# EAGLE design InstrumentHubs (EAGLE 7.6.0)

## Sheet 1 of 9
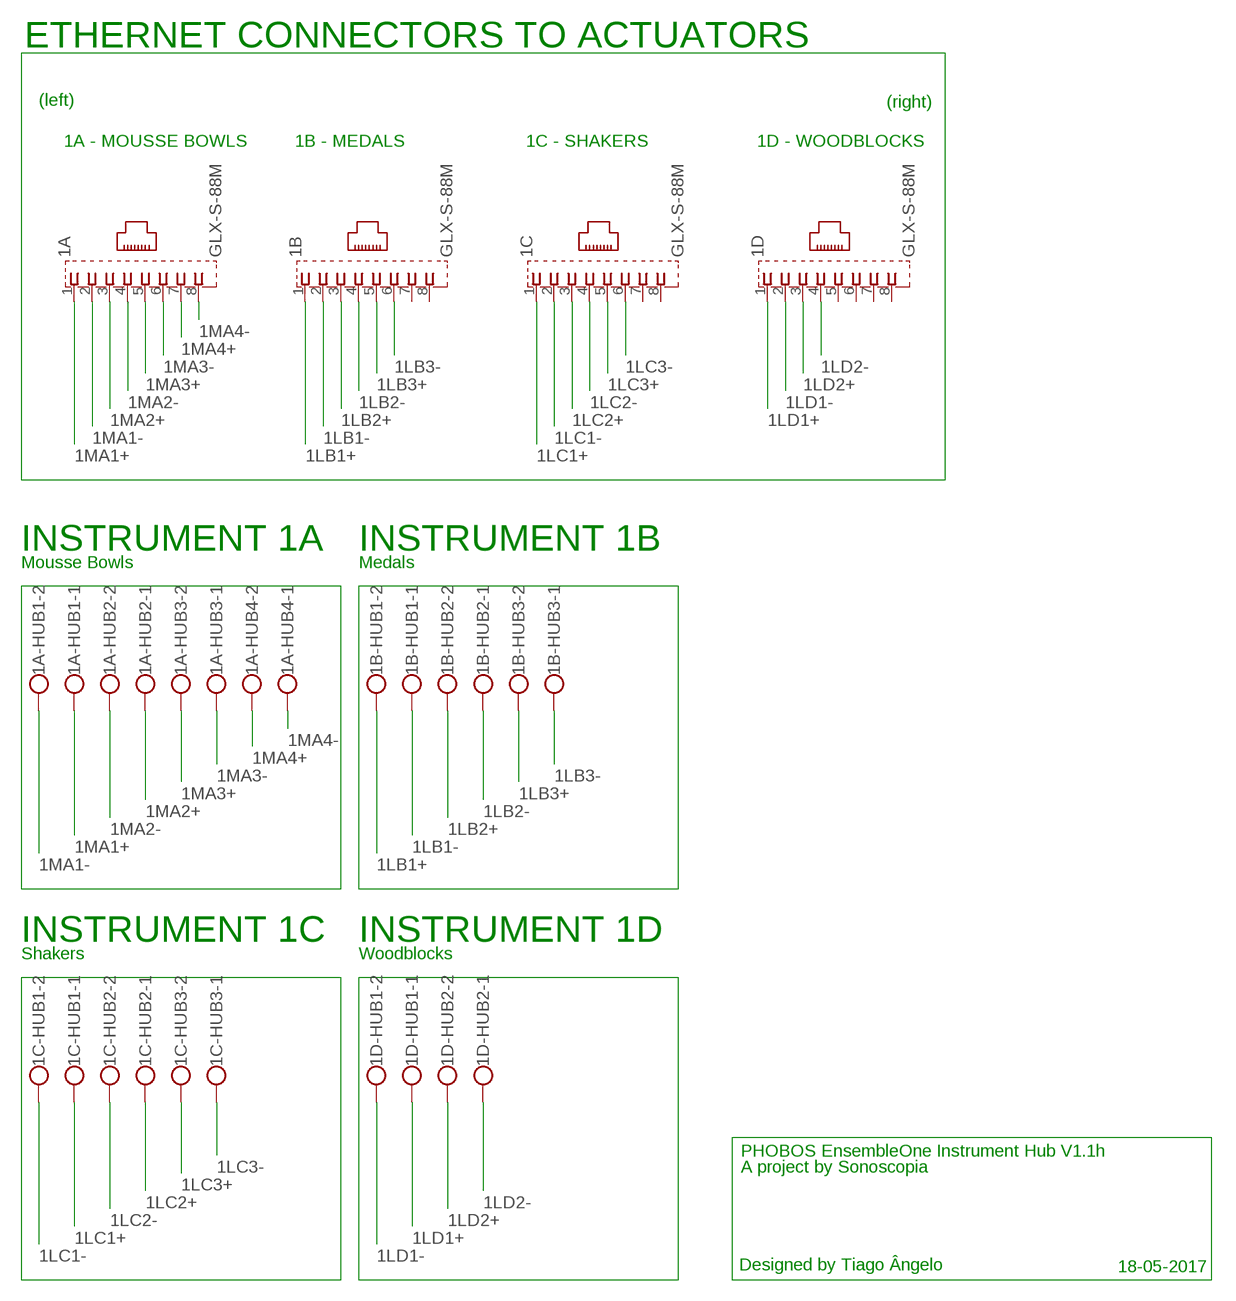
[diagram p0: schematic, sheet 1]

### Parts
1A  GLX-S-88M  [GLX-S-88M]
1A-HUB1  W237-102  [W237-102]
1A-HUB2  W237-102  [W237-102]
1A-HUB3  W237-102  [W237-102]
1A-HUB4  W237-102  [W237-102]
1B  GLX-S-88M  [GLX-S-88M]
1B-HUB1  W237-102  [W237-102]
1B-HUB2  W237-102  [W237-102]
1B-HUB3  W237-102  [W237-102]
1C  GLX-S-88M  [GLX-S-88M]
1C-HUB1  W237-102  [W237-102]
1C-HUB2  W237-102  [W237-102]
1C-HUB3  W237-102  [W237-102]
1D  GLX-S-88M  [GLX-S-88M]
1D-HUB1  W237-102  [W237-102]
1D-HUB2  W237-102  [W237-102]

### Nets
1LB1+: 1B-HUB1.2 1B.1
1LB1-: 1B-HUB1.1 1B.2
1LB2+: 1B-HUB2.2 1B.3
1LB2-: 1B-HUB2.1 1B.4
1LB3+: 1B-HUB3.2 1B.5
1LB3-: 1B-HUB3.1 1B.6
1LC1+: 1C-HUB1.1 1C.1
1LC1-: 1C-HUB1.2 1C.2
1LC2+: 1C-HUB2.1 1C.3
1LC2-: 1C-HUB2.2 1C.4
1LC3+: 1C-HUB3.2 1C.5
1LC3-: 1C-HUB3.1 1C.6
1LD1+: 1D-HUB1.1 1D.1
1LD1-: 1D-HUB1.2 1D.2
1LD2+: 1D-HUB2.2 1D.3
1LD2-: 1D-HUB2.1 1D.4
1MA1+: 1A-HUB1.1 1A.1
1MA1-: 1A-HUB1.2 1A.2
1MA2+: 1A-HUB2.1 1A.3
1MA2-: 1A-HUB2.2 1A.4
1MA3+: 1A-HUB3.2 1A.5
1MA3-: 1A-HUB3.1 1A.6
1MA4+: 1A-HUB4.2 1A.7
1MA4-: 1A-HUB4.1 1A.8
Unconnected: 1B.7 1B.8 1C.7 1C.8 1D.5 1D.6 1D.7 1D.8

### Notes on the sheet
- ETHERNET CONNECTORS TO ACTUATORS
- (left) | (right)
- 1A - MOUSSE BOWLS | 1B - MEDALS | 1C - SHAKERS | 1D - WOODBLOCKS
- INSTRUMENT 1A | INSTRUMENT 1B
- Mousse Bowls | Medals
- INSTRUMENT 1C | INSTRUMENT 1D
- Shakers | Woodblocks
- PHOBOS EnsembleOne Instrument Hub V1.1h
- A project by Sonoscopia
- Designed by Tiago Ângelo | 18-05-2017

## Sheet 2 of 9
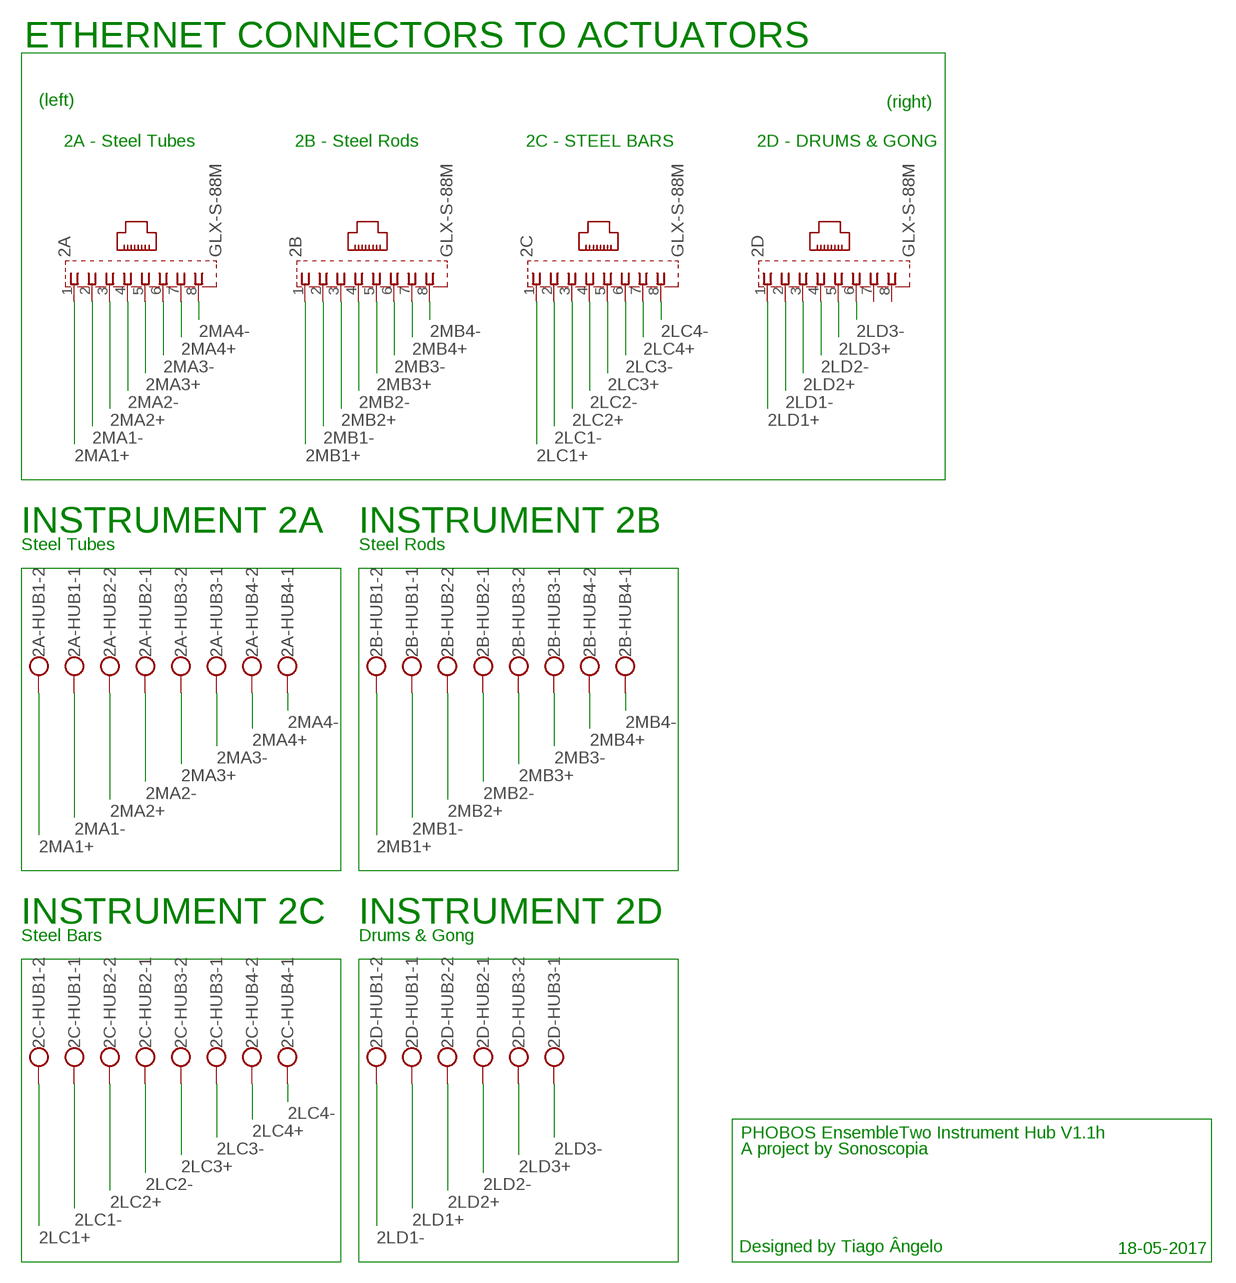
[diagram p1: schematic, sheet 2]

### Parts
2A  GLX-S-88M  [GLX-S-88M]
2A-HUB1  W237-102  [W237-102]
2A-HUB2  W237-102  [W237-102]
2A-HUB3  W237-102  [W237-102]
2A-HUB4  W237-102  [W237-102]
2B  GLX-S-88M  [GLX-S-88M]
2B-HUB1  W237-102  [W237-102]
2B-HUB2  W237-102  [W237-102]
2B-HUB3  W237-102  [W237-102]
2B-HUB4  W237-102  [W237-102]
2C  GLX-S-88M  [GLX-S-88M]
2C-HUB1  W237-102  [W237-102]
2C-HUB2  W237-102  [W237-102]
2C-HUB3  W237-102  [W237-102]
2C-HUB4  W237-102  [W237-102]
2D  GLX-S-88M  [GLX-S-88M]
2D-HUB1  W237-102  [W237-102]
2D-HUB2  W237-102  [W237-102]
2D-HUB3  W237-102  [W237-102]

### Nets
2LC1+: 2C-HUB1.2 2C.1
2LC1-: 2C-HUB1.1 2C.2
2LC2+: 2C-HUB2.2 2C.3
2LC2-: 2C-HUB2.1 2C.4
2LC3+: 2C-HUB3.2 2C.5
2LC3-: 2C-HUB3.1 2C.6
2LC4+: 2C-HUB4.2 2C.7
2LC4-: 2C-HUB4.1 2C.8
2LD1+: 2D-HUB1.1 2D.1
2LD1-: 2D-HUB1.2 2D.2
2LD2+: 2D-HUB2.2 2D.3
2LD2-: 2D-HUB2.1 2D.4
2LD3+: 2D-HUB3.2 2D.5
2LD3-: 2D-HUB3.1 2D.6
2MA1+: 2A-HUB1.2 2A.1
2MA1-: 2A-HUB1.1 2A.2
2MA2+: 2A-HUB2.2 2A.3
2MA2-: 2A-HUB2.1 2A.4
2MA3+: 2A-HUB3.2 2A.5
2MA3-: 2A-HUB3.1 2A.6
2MA4+: 2A-HUB4.2 2A.7
2MA4-: 2A-HUB4.1 2A.8
2MB1+: 2B-HUB1.2 2B.1
2MB1-: 2B-HUB1.1 2B.2
2MB2+: 2B-HUB2.2 2B.3
2MB2-: 2B-HUB2.1 2B.4
2MB3+: 2B-HUB3.2 2B.5
2MB3-: 2B-HUB3.1 2B.6
2MB4+: 2B-HUB4.2 2B.7
2MB4-: 2B-HUB4.1 2B.8
Unconnected: 2D.7 2D.8

### Notes on the sheet
- ETHERNET CONNECTORS TO ACTUATORS
- (left) | (right)
- 2A - Steel Tubes | 2B - Steel Rods | 2C - STEEL BARS | 2D - DRUMS & GONG
- INSTRUMENT 2A | INSTRUMENT 2B
- Steel Tubes | Steel Rods
- INSTRUMENT 2C | INSTRUMENT 2D
- Steel Bars | Drums & Gong
- PHOBOS EnsembleTwo Instrument Hub V1.1h
- A project by Sonoscopia
- Designed by Tiago Ângelo | 18-05-2017

## Sheet 3 of 9
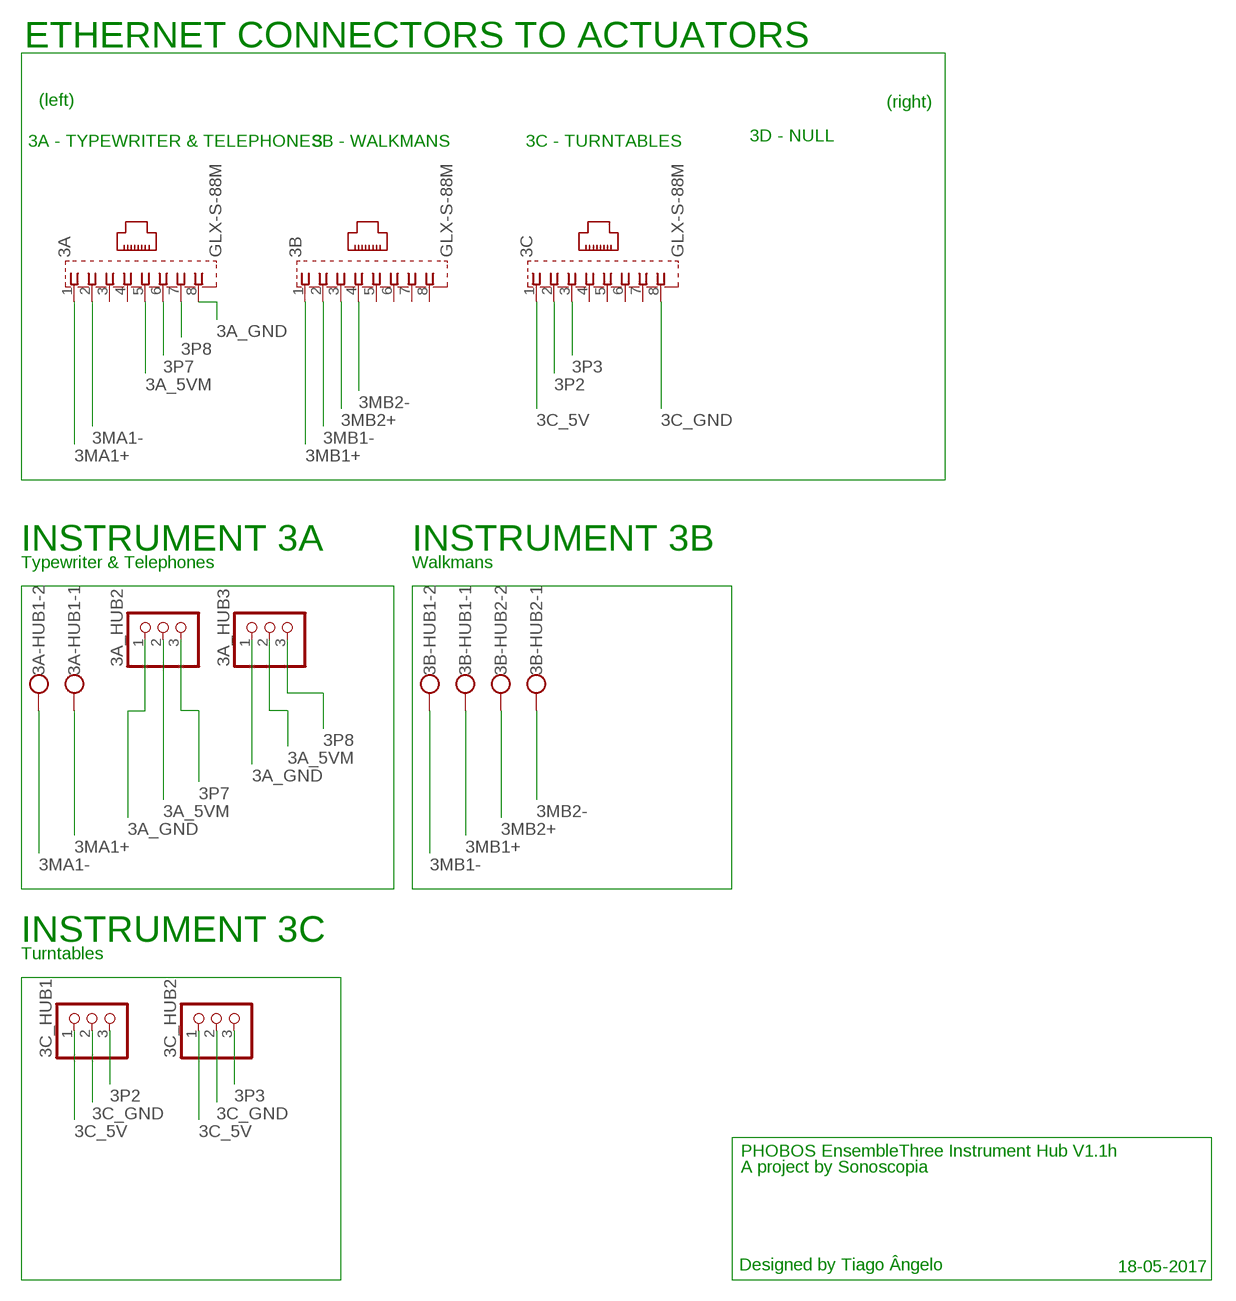
[diagram p2: schematic, sheet 3]

### Parts
3A  GLX-S-88M  [GLX-S-88M]
3A-HUB1  W237-102  [W237-102]
3A_HUB2  PINHD-1X3  [1X03]
3A_HUB3  PINHD-1X3  [1X03]
3B  GLX-S-88M  [GLX-S-88M]
3B-HUB1  W237-102  [W237-102]
3B-HUB2  W237-102  [W237-102]
3C  GLX-S-88M  [GLX-S-88M]
3C_HUB1  PINHD-1X3  [1X03]
3C_HUB2  PINHD-1X3  [1X03]

### Nets
3A_5VM: 3A.5 3A_HUB2.2 3A_HUB3.2
3A_GND [GND]: 3A.8 3A_HUB2.1 3A_HUB3.1
3C_5V: 3C.1 3C_HUB1.1 3C_HUB2.1
3C_GND [GND]: 3C.8 3C_HUB1.2 3C_HUB2.2
3MA1+: 3A-HUB1.1 3A.1
3MA1-: 3A-HUB1.2 3A.2
3MB1+: 3B-HUB1.1 3B.1
3MB1-: 3B-HUB1.2 3B.2
3MB2+: 3B-HUB2.2 3B.3
3MB2-: 3B-HUB2.1 3B.4
3P2: 3C.2 3C_HUB1.3
3P3: 3C.3 3C_HUB2.3
3P7: 3A.6 3A_HUB2.3
3P8: 3A.7 3A_HUB3.3
Unconnected: 3A.3 3A.4 3B.5 3B.6 3B.7 3B.8 3C.4 3C.5 3C.6 3C.7

### Notes on the sheet
- ETHERNET CONNECTORS TO ACTUATORS
- (left) | (right)
- 3D - NULL
- 3A - TYPEWRITER & TELEPHONES | 3B - WALKMANS | 3C - TURNTABLES
- INSTRUMENT 3A | INSTRUMENT 3B
- Typewriter & Telephones | Walkmans
- INSTRUMENT 3C
- Turntables
- PHOBOS EnsembleThree Instrument Hub V1.1h
- A project by Sonoscopia
- Designed by Tiago Ângelo | 18-05-2017

## Sheet 4 of 9
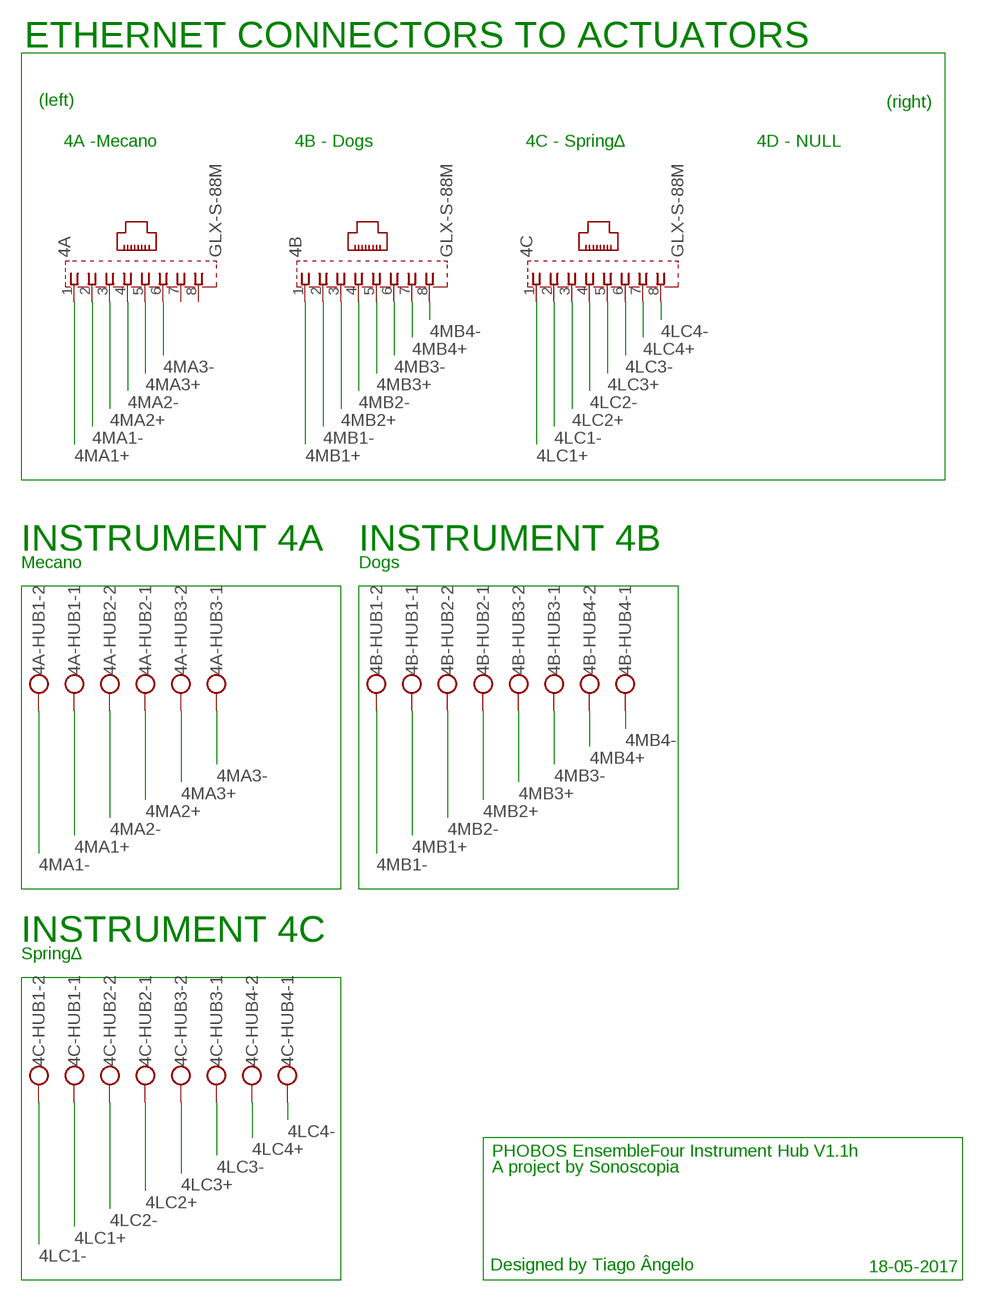
[diagram p3: schematic, sheet 4]

### Parts
4A  GLX-S-88M  [GLX-S-88M]
4A-HUB1  W237-102  [W237-102]
4A-HUB2  W237-102  [W237-102]
4A-HUB3  W237-102  [W237-102]
4B  GLX-S-88M  [GLX-S-88M]
4B-HUB1  W237-102  [W237-102]
4B-HUB2  W237-102  [W237-102]
4B-HUB3  W237-102  [W237-102]
4B-HUB4  W237-102  [W237-102]
4C  GLX-S-88M  [GLX-S-88M]
4C-HUB1  W237-102  [W237-102]
4C-HUB2  W237-102  [W237-102]
4C-HUB3  W237-102  [W237-102]
4C-HUB4  W237-102  [W237-102]

### Nets
4LC1+: 4C-HUB1.1 4C.1
4LC1-: 4C-HUB1.2 4C.2
4LC2+: 4C-HUB2.1 4C.3
4LC2-: 4C-HUB2.2 4C.4
4LC3+: 4C-HUB3.2 4C.5
4LC3-: 4C-HUB3.1 4C.6
4LC4+: 4C-HUB4.2 4C.7
4LC4-: 4C-HUB4.1 4C.8
4MA1+: 4A-HUB1.1 4A.1
4MA1-: 4A-HUB1.2 4A.2
4MA2+: 4A-HUB2.1 4A.3
4MA2-: 4A-HUB2.2 4A.4
4MA3+: 4A-HUB3.2 4A.5
4MA3-: 4A-HUB3.1 4A.6
4MB1+: 4B-HUB1.1 4B.1
4MB1-: 4B-HUB1.2 4B.2
4MB2+: 4B-HUB2.1 4B.3
4MB2-: 4B-HUB2.2 4B.4
4MB3+: 4B-HUB3.2 4B.5
4MB3-: 4B-HUB3.1 4B.6
4MB4+: 4B-HUB4.2 4B.7
4MB4-: 4B-HUB4.1 4B.8
Unconnected: 4A.7 4A.8

### Notes on the sheet
- ETHERNET CONNECTORS TO ACTUATORS
- (left) | (right)
- 4A -Mecano | 4B - Dogs | 4C - Spring∆ | 4D - NULL
- INSTRUMENT 4A | INSTRUMENT 4B
- Mecano | Dogs
- INSTRUMENT 4C
- Spring∆
- PHOBOS EnsembleFour Instrument Hub V1.1h
- A project by Sonoscopia
- Designed by Tiago Ângelo | 18-05-2017

## Sheet 5 of 9
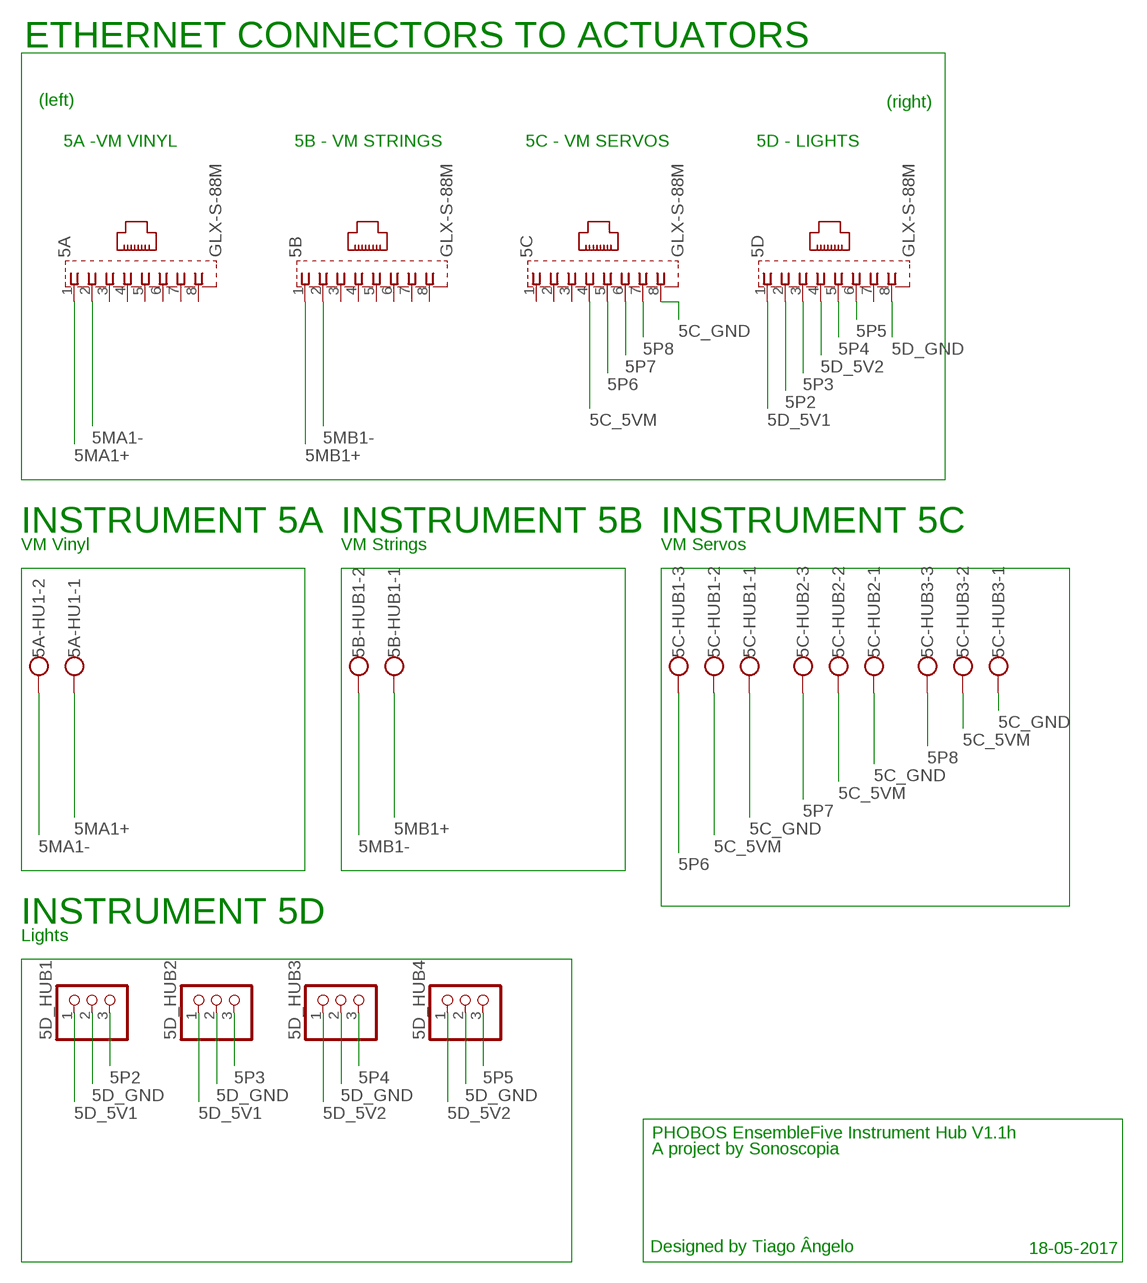
[diagram p4: schematic, sheet 5]

### Parts
5A  GLX-S-88M  [GLX-S-88M]
5A-HU1  W237-102  [W237-102]
5B  GLX-S-88M  [GLX-S-88M]
5B-HUB1  W237-102  [W237-102]
5C  GLX-S-88M  [GLX-S-88M]
5C-HUB1  W237-103  [W237-103]
5C-HUB2  W237-103  [W237-103]
5C-HUB3  W237-103  [W237-103]
5D  GLX-S-88M  [GLX-S-88M]
5D_HUB1  PINHD-1X3  [1X03]
5D_HUB2  PINHD-1X3  [1X03]
5D_HUB3  PINHD-1X3  [1X03]
5D_HUB4  PINHD-1X3  [1X03]

### Nets
5C_5VM: 5C-HUB1.2 5C-HUB2.2 5C-HUB3.2 5C.4
5C_GND [GND]: 5C-HUB1.1 5C-HUB2.1 5C-HUB3.1 5C.8
5D_5V1: 5D.1 5D_HUB1.1 5D_HUB2.1
5D_5V2: 5D.4 5D_HUB3.1 5D_HUB4.1
5D_GND [GND]: 5D.8 5D_HUB1.2 5D_HUB2.2 5D_HUB3.2 5D_HUB4.2
5MA1+: 5A-HU1.1 5A.1
5MA1-: 5A-HU1.2 5A.2
5MB1+: 5B-HUB1.1 5B.1
5MB1-: 5B-HUB1.2 5B.2
5P2: 5D.2 5D_HUB1.3
5P3: 5D.3 5D_HUB2.3
5P4: 5D.5 5D_HUB3.3
5P5: 5D.6 5D_HUB4.3
5P6: 5C-HUB1.3 5C.5
5P7: 5C-HUB2.3 5C.6
5P8: 5C-HUB3.3 5C.7
Unconnected: 5A.3 5A.4 5A.5 5A.6 5A.7 5A.8 5B.3 5B.4 5B.5 5B.6 5B.7 5B.8 5C.1 5C.2 5C.3 5D.7

### Notes on the sheet
- ETHERNET CONNECTORS TO ACTUATORS
- (left) | (right)
- 5A -VM VINYL | 5B - VM STRINGS | 5C - VM SERVOS | 5D - LIGHTS
- INSTRUMENT 5A | INSTRUMENT 5B | INSTRUMENT 5C
- VM Vinyl | VM Strings | VM Servos
- INSTRUMENT 5D
- Lights
- PHOBOS EnsembleFive Instrument Hub V1.1h
- A project by Sonoscopia
- Designed by Tiago Ângelo | 18-05-2017

## Sheet 6 of 9
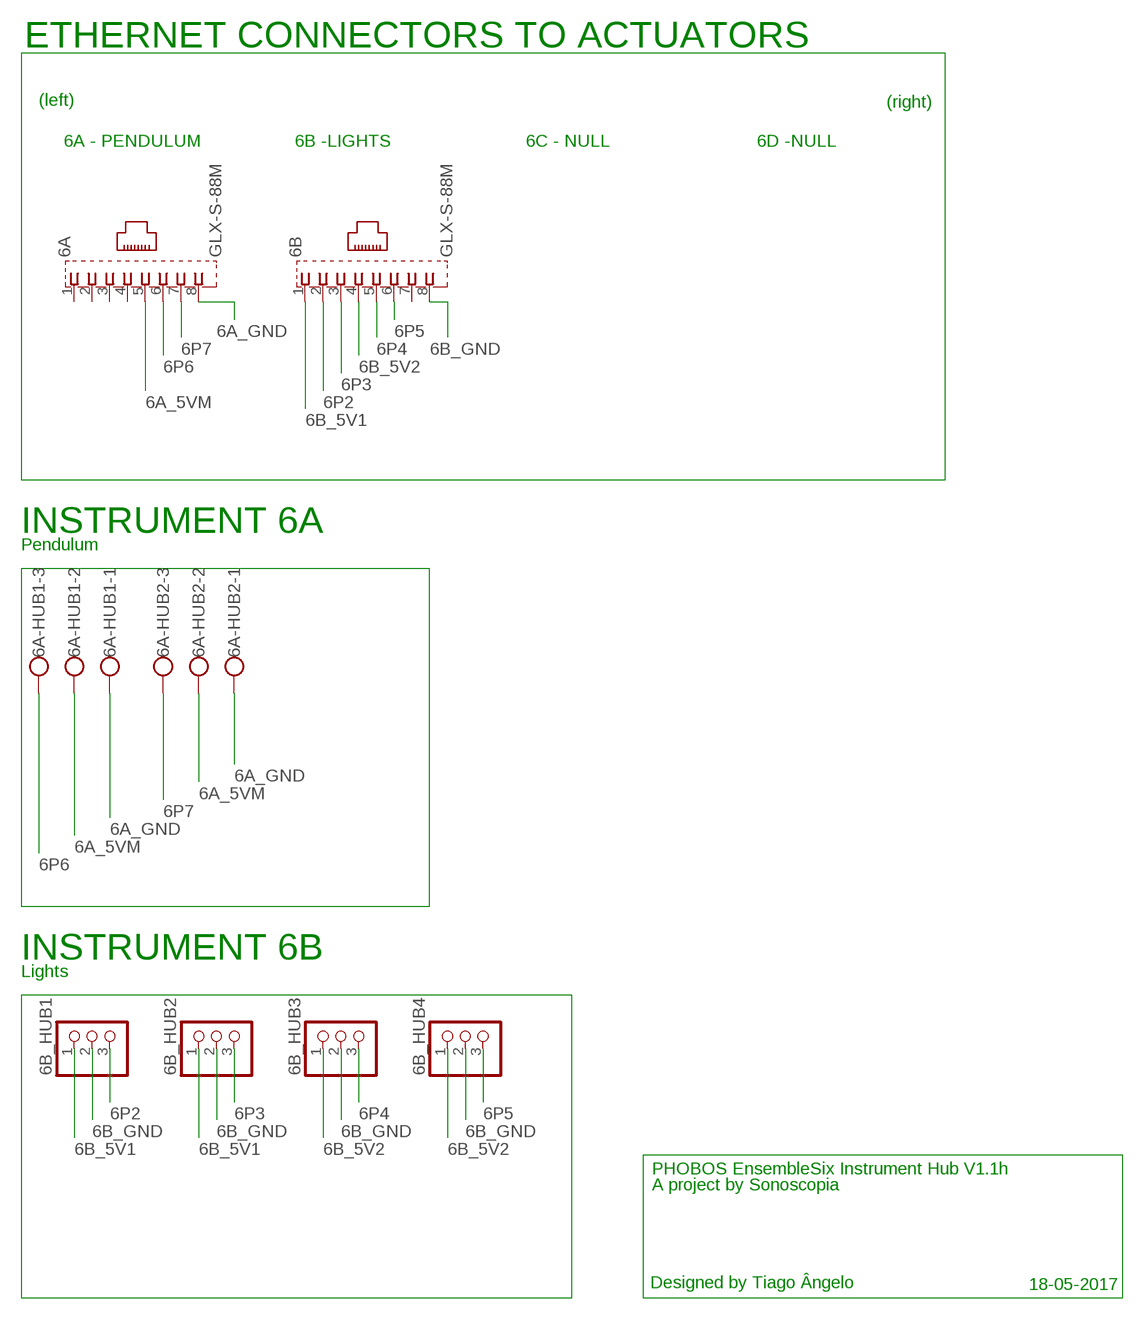
[diagram p5: schematic, sheet 6]

### Parts
6A  GLX-S-88M  [GLX-S-88M]
6A-HUB1  W237-103  [W237-103]
6A-HUB2  W237-103  [W237-103]
6B  GLX-S-88M  [GLX-S-88M]
6B_HUB1  PINHD-1X3  [1X03]
6B_HUB2  PINHD-1X3  [1X03]
6B_HUB3  PINHD-1X3  [1X03]
6B_HUB4  PINHD-1X3  [1X03]

### Nets
6A_5VM [5VM]: 6A-HUB1.2 6A-HUB2.2 6A.5
6A_GND [GND]: 6A-HUB1.1 6A-HUB2.1 6A.8
6B_5V1: 6B.1 6B_HUB1.1 6B_HUB2.1
6B_5V2: 6B.4 6B_HUB3.1 6B_HUB4.1
6B_GND [GND]: 6B.8 6B_HUB1.2 6B_HUB2.2 6B_HUB3.2 6B_HUB4.2
6P2: 6B.2 6B_HUB1.3
6P3: 6B.3 6B_HUB2.3
6P4: 6B.5 6B_HUB3.3
6P5: 6B.6 6B_HUB4.3
6P6: 6A-HUB1.3 6A.6
6P7: 6A-HUB2.3 6A.7
Unconnected: 6A.1 6A.2 6A.3 6A.4 6B.7

### Notes on the sheet
- ETHERNET CONNECTORS TO ACTUATORS
- (left) | (right)
- 6A - PENDULUM | 6B -LIGHTS | 6C - NULL | 6D -NULL
- INSTRUMENT 6A
- Pendulum
- INSTRUMENT 6B
- Lights
- PHOBOS EnsembleSix Instrument Hub V1.1h
- A project by Sonoscopia
- Designed by Tiago Ângelo | 18-05-2017

## Sheet 7 of 9
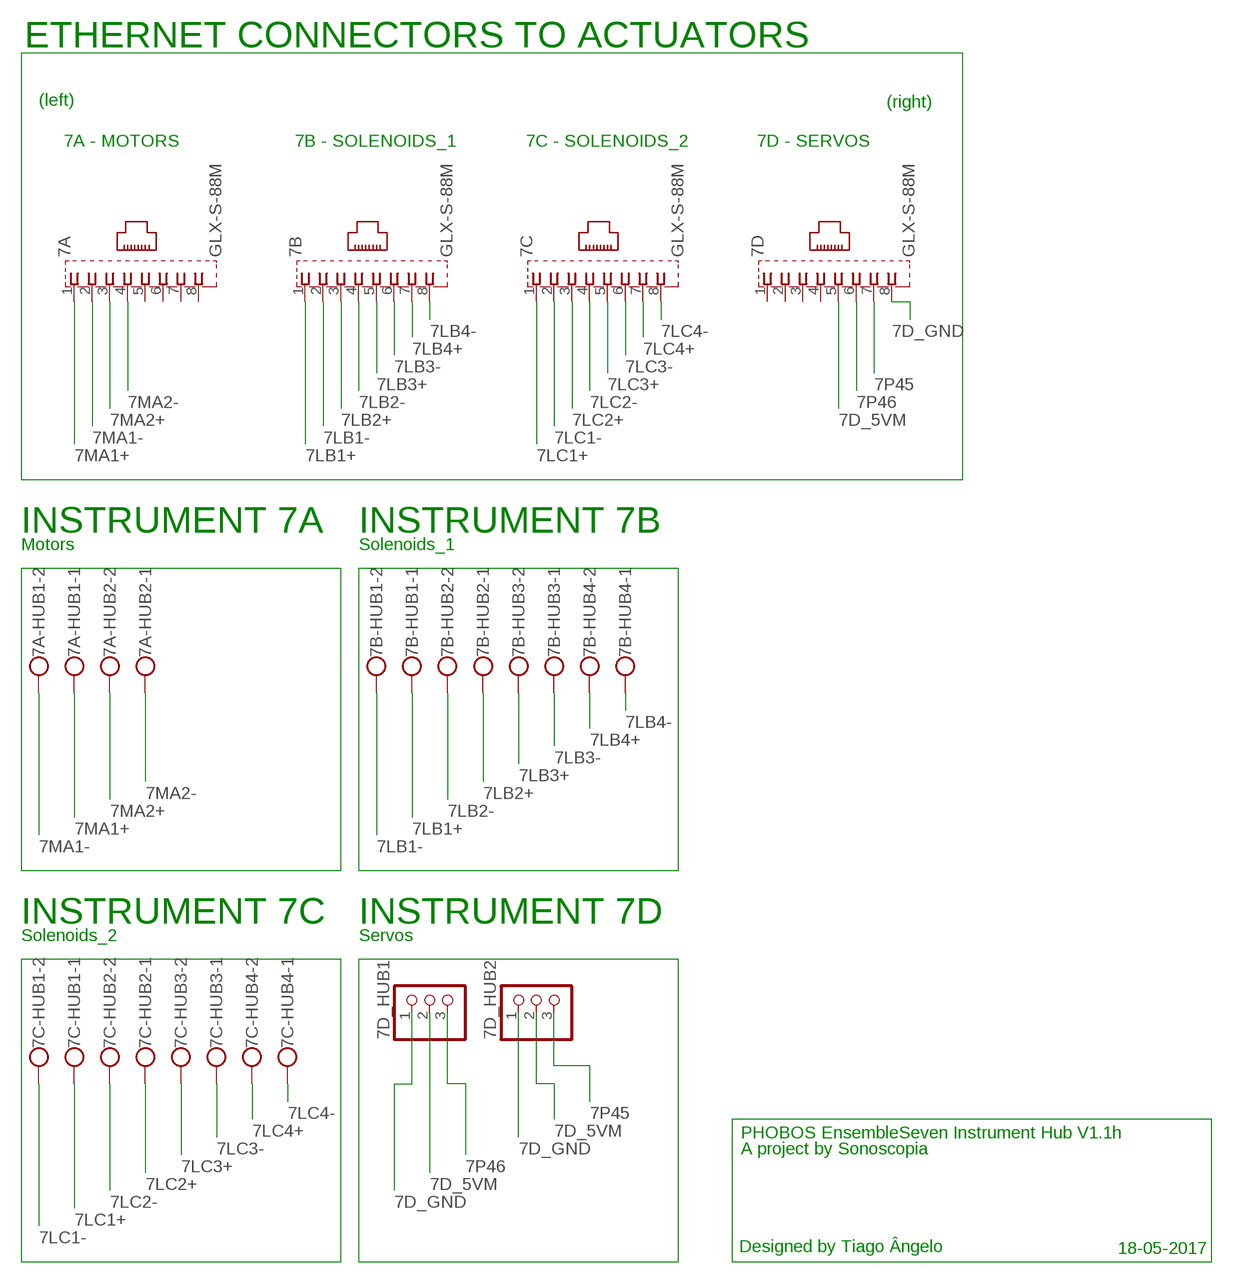
[diagram p6: schematic, sheet 7]

### Parts
7A  GLX-S-88M  [GLX-S-88M]
7A-HUB1  W237-102  [W237-102]
7A-HUB2  W237-102  [W237-102]
7B  GLX-S-88M  [GLX-S-88M]
7B-HUB1  W237-102  [W237-102]
7B-HUB2  W237-102  [W237-102]
7B-HUB3  W237-102  [W237-102]
7B-HUB4  W237-102  [W237-102]
7C  GLX-S-88M  [GLX-S-88M]
7C-HUB1  W237-102  [W237-102]
7C-HUB2  W237-102  [W237-102]
7C-HUB3  W237-102  [W237-102]
7C-HUB4  W237-102  [W237-102]
7D  GLX-S-88M  [GLX-S-88M]
7D_HUB1  PINHD-1X3  [1X03]
7D_HUB2  PINHD-1X3  [1X03]

### Nets
7D_5VM: 7D.5 7D_HUB1.2 7D_HUB2.2
7D_GND [GND]: 7D.8 7D_HUB1.1 7D_HUB2.1
7LB1+: 7B-HUB1.1 7B.1
7LB1-: 7B-HUB1.2 7B.2
7LB2+: 7B-HUB2.1 7B.3
7LB2-: 7B-HUB2.2 7B.4
7LB3+: 7B-HUB3.2 7B.5
7LB3-: 7B-HUB3.1 7B.6
7LB4+: 7B-HUB4.2 7B.7
7LB4-: 7B-HUB4.1 7B.8
7LC1+: 7C-HUB1.1 7C.1
7LC1-: 7C-HUB1.2 7C.2
7LC2+: 7C-HUB2.1 7C.3
7LC2-: 7C-HUB2.2 7C.4
7LC3+: 7C-HUB3.2 7C.5
7LC3-: 7C-HUB3.1 7C.6
7LC4+: 7C-HUB4.2 7C.7
7LC4-: 7C-HUB4.1 7C.8
7MA1+: 7A-HUB1.1 7A.1
7MA1-: 7A-HUB1.2 7A.2
7MA2+: 7A-HUB2.2 7A.3
7MA2-: 7A-HUB2.1 7A.4
7P45: 7D.7 7D_HUB2.3
7P46: 7D.6 7D_HUB1.3
Unconnected: 7A.5 7A.6 7A.7 7A.8 7D.1 7D.2 7D.3 7D.4

### Notes on the sheet
- ETHERNET CONNECTORS TO ACTUATORS
- (left) | (right)
- 7A - MOTORS | 7B - SOLENOIDS_1 | 7C - SOLENOIDS_2 | 7D - SERVOS
- INSTRUMENT 7A | INSTRUMENT 7B
- Motors | Solenoids_1
- INSTRUMENT 7C | INSTRUMENT 7D
- Solenoids_2 | Servos
- PHOBOS EnsembleSeven Instrument Hub V1.1h
- A project by Sonoscopia
- Designed by Tiago Ângelo | 18-05-2017

## Sheet 8 of 9
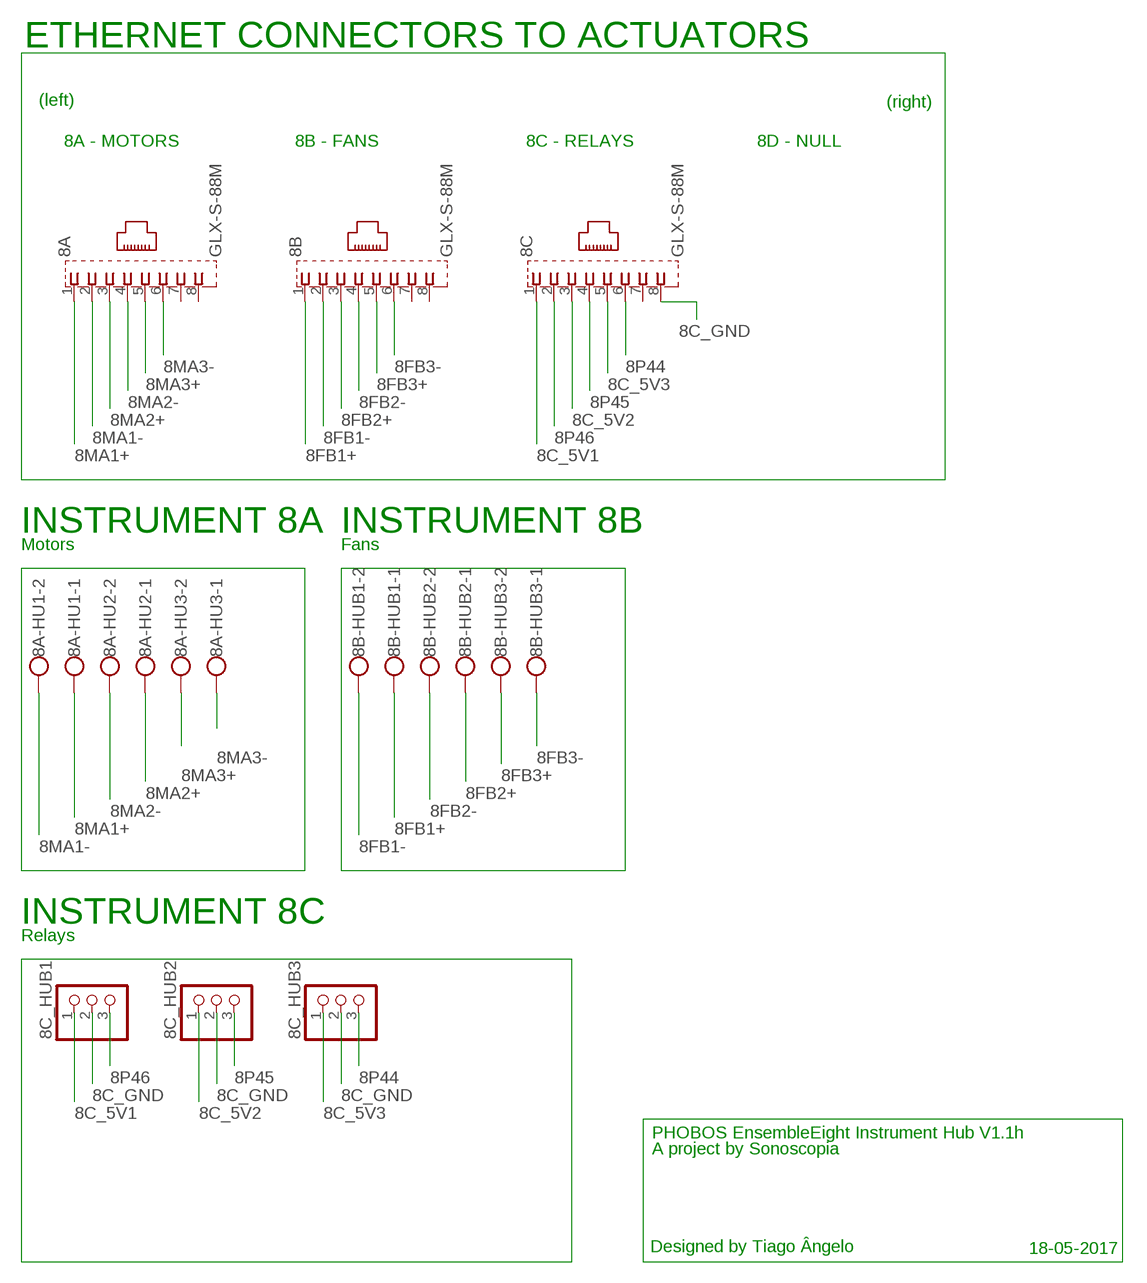
[diagram p7: schematic, sheet 8]

### Parts
8A  GLX-S-88M  [GLX-S-88M]
8A-HU1  W237-102  [W237-102]
8A-HU2  W237-102  [W237-102]
8A-HU3  W237-102  [W237-102]
8B  GLX-S-88M  [GLX-S-88M]
8B-HUB1  W237-102  [W237-102]
8B-HUB2  W237-102  [W237-102]
8B-HUB3  W237-102  [W237-102]
8C  GLX-S-88M  [GLX-S-88M]
8C_HUB1  PINHD-1X3  [1X03]
8C_HUB2  PINHD-1X3  [1X03]
8C_HUB3  PINHD-1X3  [1X03]

### Nets
8C_5V1: 8C.1 8C_HUB1.1
8C_5V2: 8C.3 8C_HUB2.1
8C_5V3: 8C.5 8C_HUB3.1
8C_GND [GND]: 8C.8 8C_HUB1.2 8C_HUB2.2 8C_HUB3.2
8FB1+: 8B-HUB1.1 8B.1
8FB1-: 8B-HUB1.2 8B.2
8FB2+: 8B-HUB2.1 8B.3
8FB2-: 8B-HUB2.2 8B.4
8FB3+: 8B-HUB3.2 8B.5
8FB3-: 8B-HUB3.1 8B.6
8MA1+: 8A-HU1.1 8A.1
8MA1-: 8A-HU1.2 8A.2
8MA2+: 8A-HU2.1 8A.3
8MA2-: 8A-HU2.2 8A.4
8MA3+: 8A-HU3.2 8A.5
8MA3-: 8A-HU3.1 8A.6
8P44: 8C.6 8C_HUB3.3
8P45: 8C.4 8C_HUB2.3
8P46: 8C.2 8C_HUB1.3
Unconnected: 8A.7 8A.8 8B.7 8B.8 8C.7

### Notes on the sheet
- ETHERNET CONNECTORS TO ACTUATORS
- (left) | (right)
- 8A - MOTORS | 8B - FANS | 8C - RELAYS | 8D - NULL
- INSTRUMENT 8A | INSTRUMENT 8B
- Motors | Fans
- INSTRUMENT 8C
- Relays
- PHOBOS EnsembleEight Instrument Hub V1.1h
- A project by Sonoscopia
- Designed by Tiago Ângelo | 18-05-2017

## Sheet 9 of 9
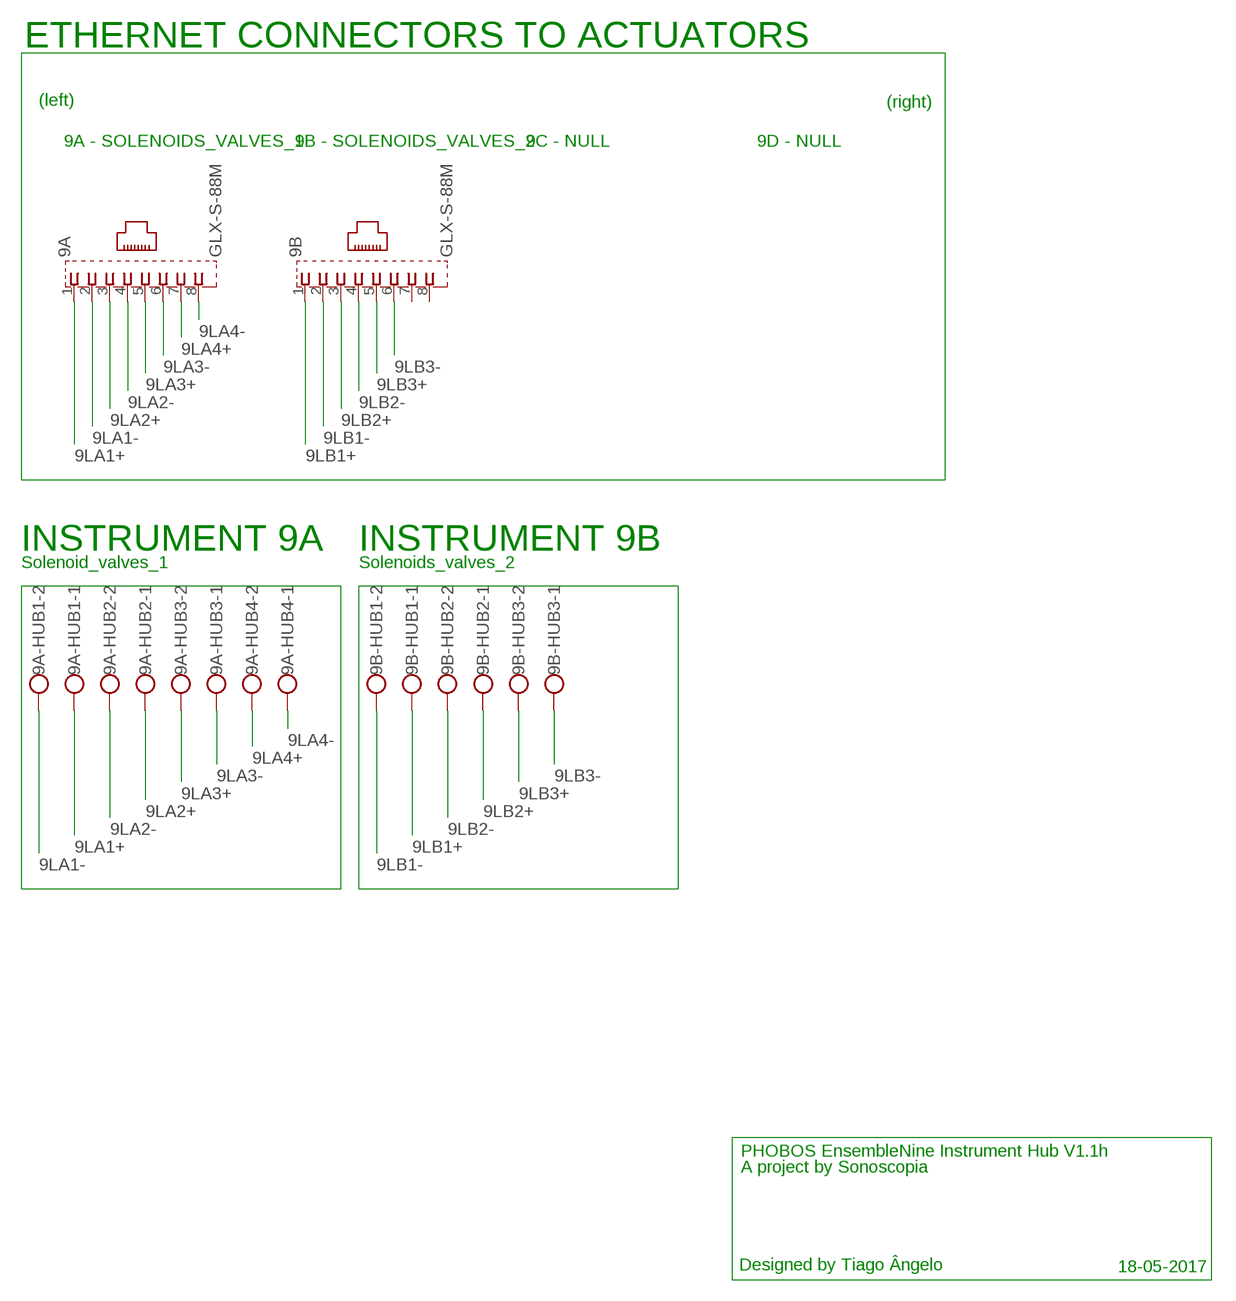
[diagram p8: schematic, sheet 9]

### Parts
9A  GLX-S-88M  [GLX-S-88M]
9A-HUB1  W237-102  [W237-102]
9A-HUB2  W237-102  [W237-102]
9A-HUB3  W237-102  [W237-102]
9A-HUB4  W237-102  [W237-102]
9B  GLX-S-88M  [GLX-S-88M]
9B-HUB1  W237-102  [W237-102]
9B-HUB2  W237-102  [W237-102]
9B-HUB3  W237-102  [W237-102]

### Nets
9LA1+: 9A-HUB1.1 9A.1
9LA1-: 9A-HUB1.2 9A.2
9LA2+: 9A-HUB2.1 9A.3
9LA2-: 9A-HUB2.2 9A.4
9LA3+: 9A-HUB3.2 9A.5
9LA3-: 9A-HUB3.1 9A.6
9LA4+: 9A-HUB4.2 9A.7
9LA4-: 9A-HUB4.1 9A.8
9LB1+: 9B-HUB1.1 9B.1
9LB1-: 9B-HUB1.2 9B.2
9LB2+: 9B-HUB2.1 9B.3
9LB2-: 9B-HUB2.2 9B.4
9LB3+: 9B-HUB3.2 9B.5
9LB3-: 9B-HUB3.1 9B.6
Unconnected: 9B.7 9B.8

### Notes on the sheet
- ETHERNET CONNECTORS TO ACTUATORS
- (left) | (right)
- 9A - SOLENOIDS_VALVES_1 | 9B - SOLENOIDS_VALVES_2 | 9C - NULL | 9D - NULL
- INSTRUMENT 9A | INSTRUMENT 9B
- Solenoid_valves_1 | Solenoids_valves_2
- PHOBOS EnsembleNine Instrument Hub V1.1h
- A project by Sonoscopia
- Designed by Tiago Ângelo | 18-05-2017

## Library data of the parts
1A 1B 1C 1D 2A 2B 2C 2D 3A 3B 3C 4A 4B 4C 5A 5B 5C 5D 6A 6B 7A 7B 7C 7D 8A 8B 8C 9A 9B = PHOBOS-lbr:GLX-S-88M: Mod. Jack, Right Angle, 8 posiotion, 8 contatcs RJ45 Source: GLX-S-88M.pdf; OC_FARNELL: unknown; OC_NEWARK: unknown
1A-HUB1-1A-HUB4 1B-HUB1-1B-HUB3 1C-HUB1-1C-HUB3 1D-HUB1 1D-HUB2 2A-HUB1-2A-HUB4 2B-HUB1-2B-HUB4 2C-HUB1-2C-HUB4 2D-HUB1-2D-HUB3 3A-HUB1 3B-HUB1 3B-HUB2 4A-HUB1-4A-HUB3 4B-HUB1-4B-HUB4 4C-HUB1-4C-HUB4 5A-HU1 5B-HUB1 7A-HUB1 7A-HUB2 7B-HUB1-7B-HUB4 7C-HUB1-7C-HUB4 8A-HU1-8A-HU3 8B-HUB1-8B-HUB3 9A-HUB1-9A-HUB4 9B-HUB1-9B-HUB3 = con-wago-500:W237-102: WAGO SCREW CLAMP; MPN: 237-102; OC_FARNELL: unknown; OC_NEWARK: 70K9898
3A_HUB2 3A_HUB3 3C_HUB1 3C_HUB2 5D_HUB1-5D_HUB4 6B_HUB1-6B_HUB4 7D_HUB1 7D_HUB2 8C_HUB1-8C_HUB3 = pinhead:PINHD-1X3: PIN HEADER
5C-HUB1-5C-HUB3 6A-HUB1 6A-HUB2 = con-wago-500:W237-103: WAGO SCREW CLAMP; MPN: 237-103; OC_FARNELL: unknown; OC_NEWARK: 18M7116

## Net classes
0 default: width 0.508 mm, drill 0.508 mm, clearance 0.406 mm
1 GND: width 1.016 mm, drill 0.508 mm, clearance 0.508 mm
2 5VM: width 1.016 mm, drill 0.508 mm, clearance 0.508 mm
3 12VL: width 0.61 mm, drill 0.508 mm, clearance 0.508 mm
4 12VA: width 0.508 mm, drill 0.508 mm, clearance 0.508 mm

## Board
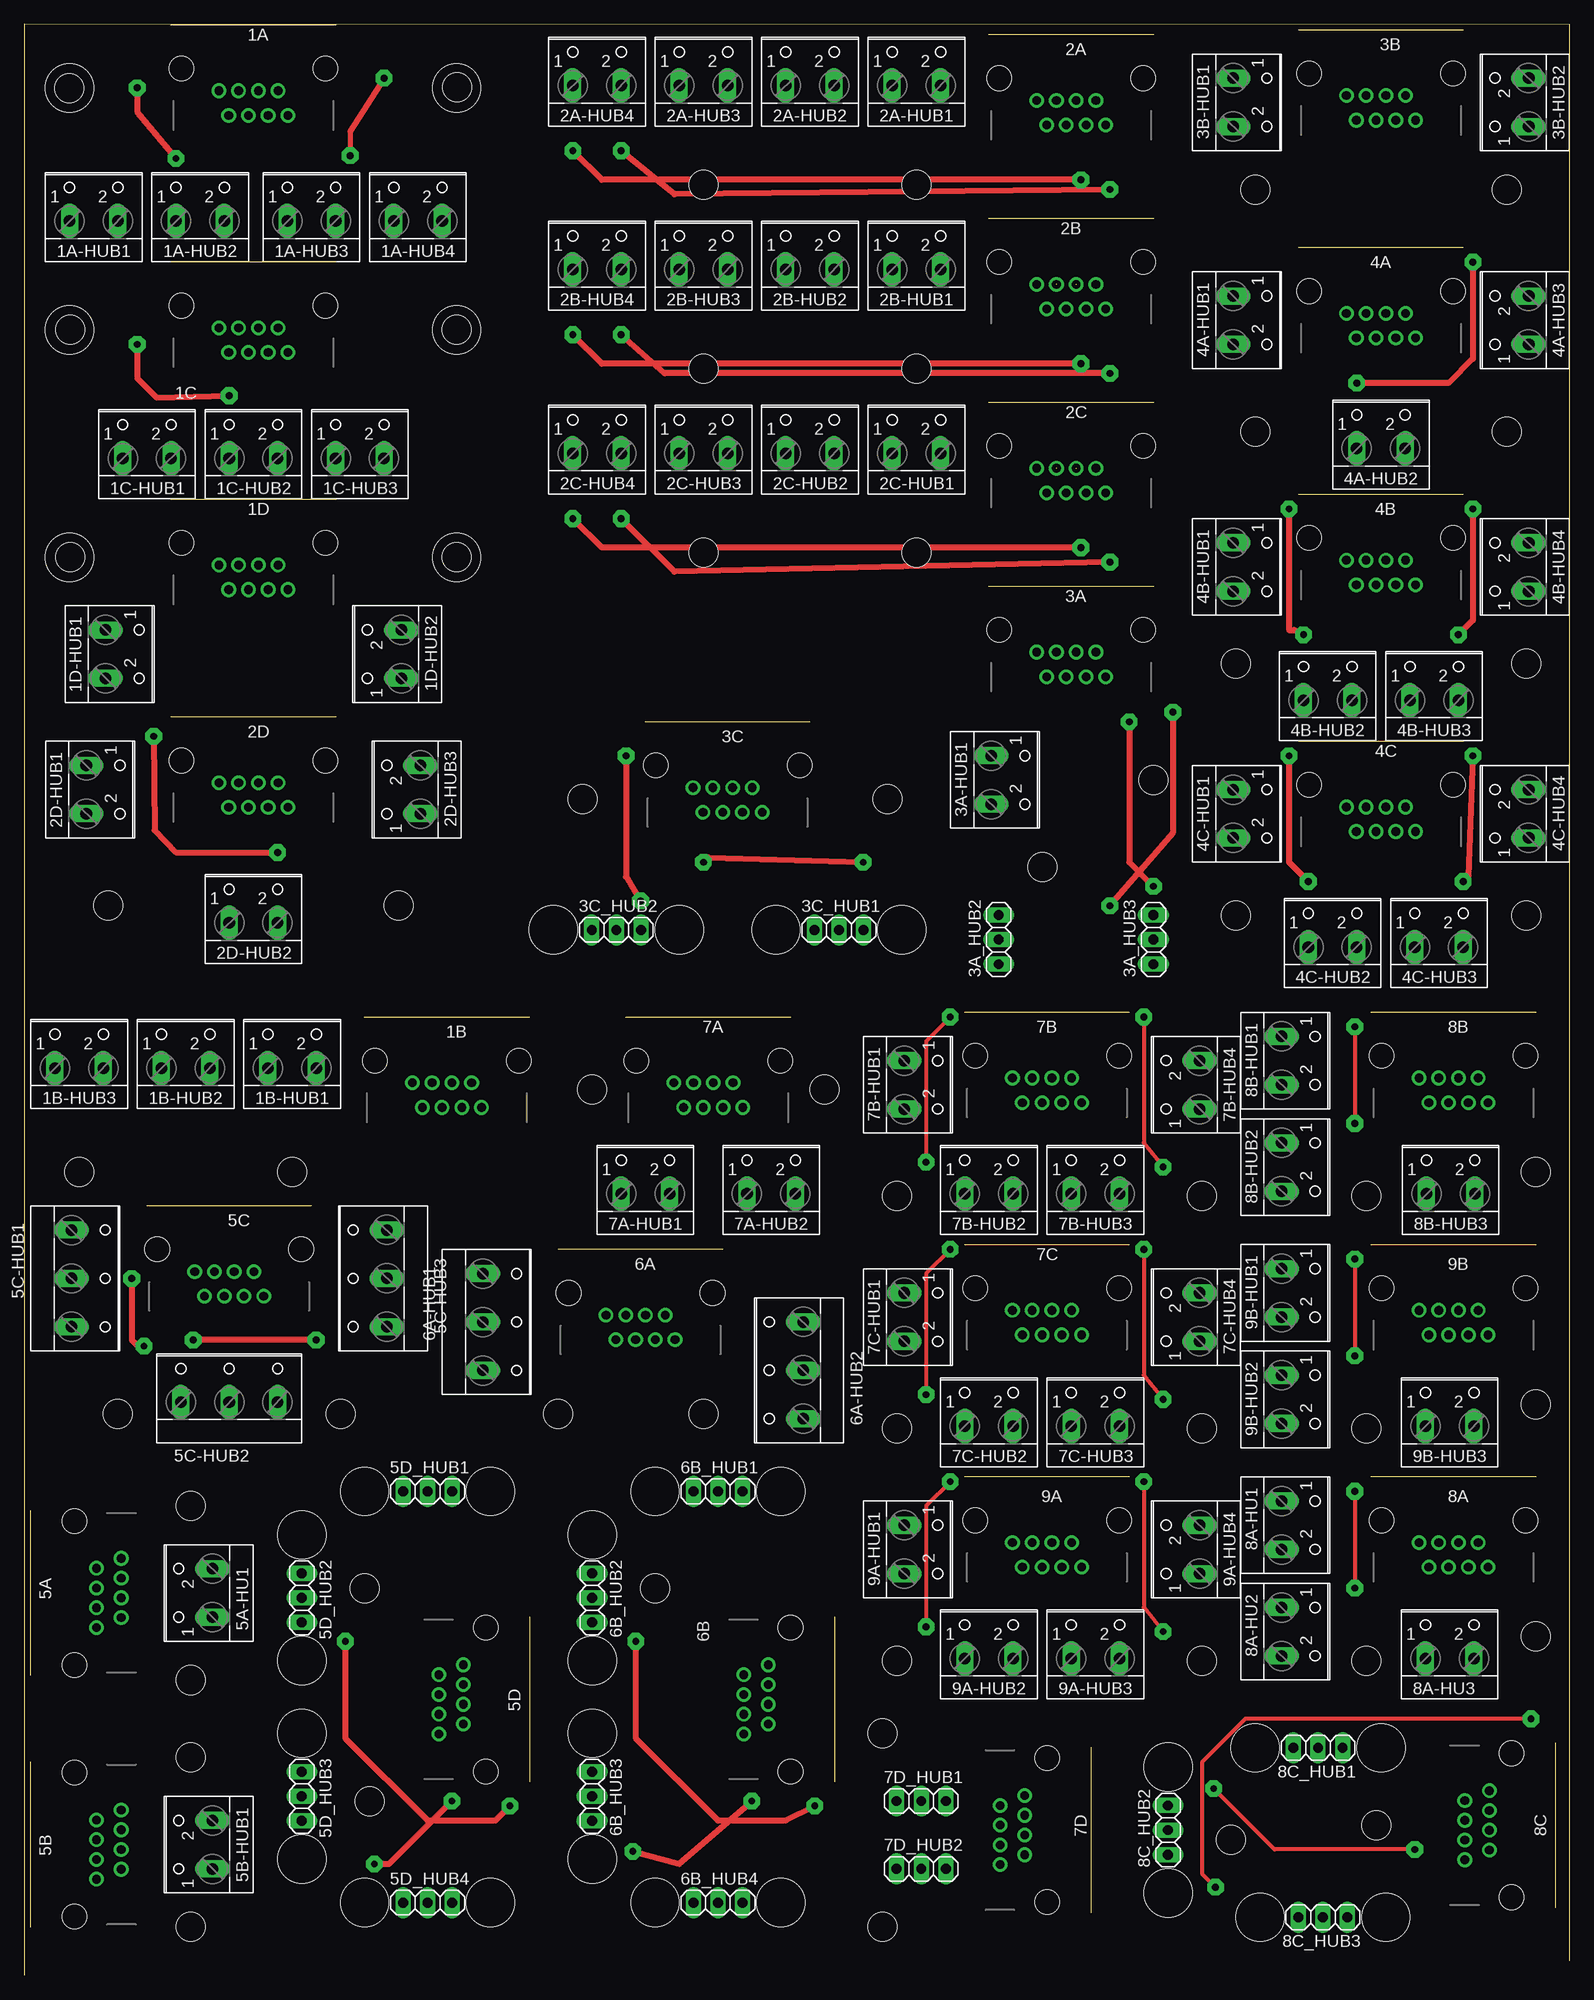
[diagram p9: board, top side]
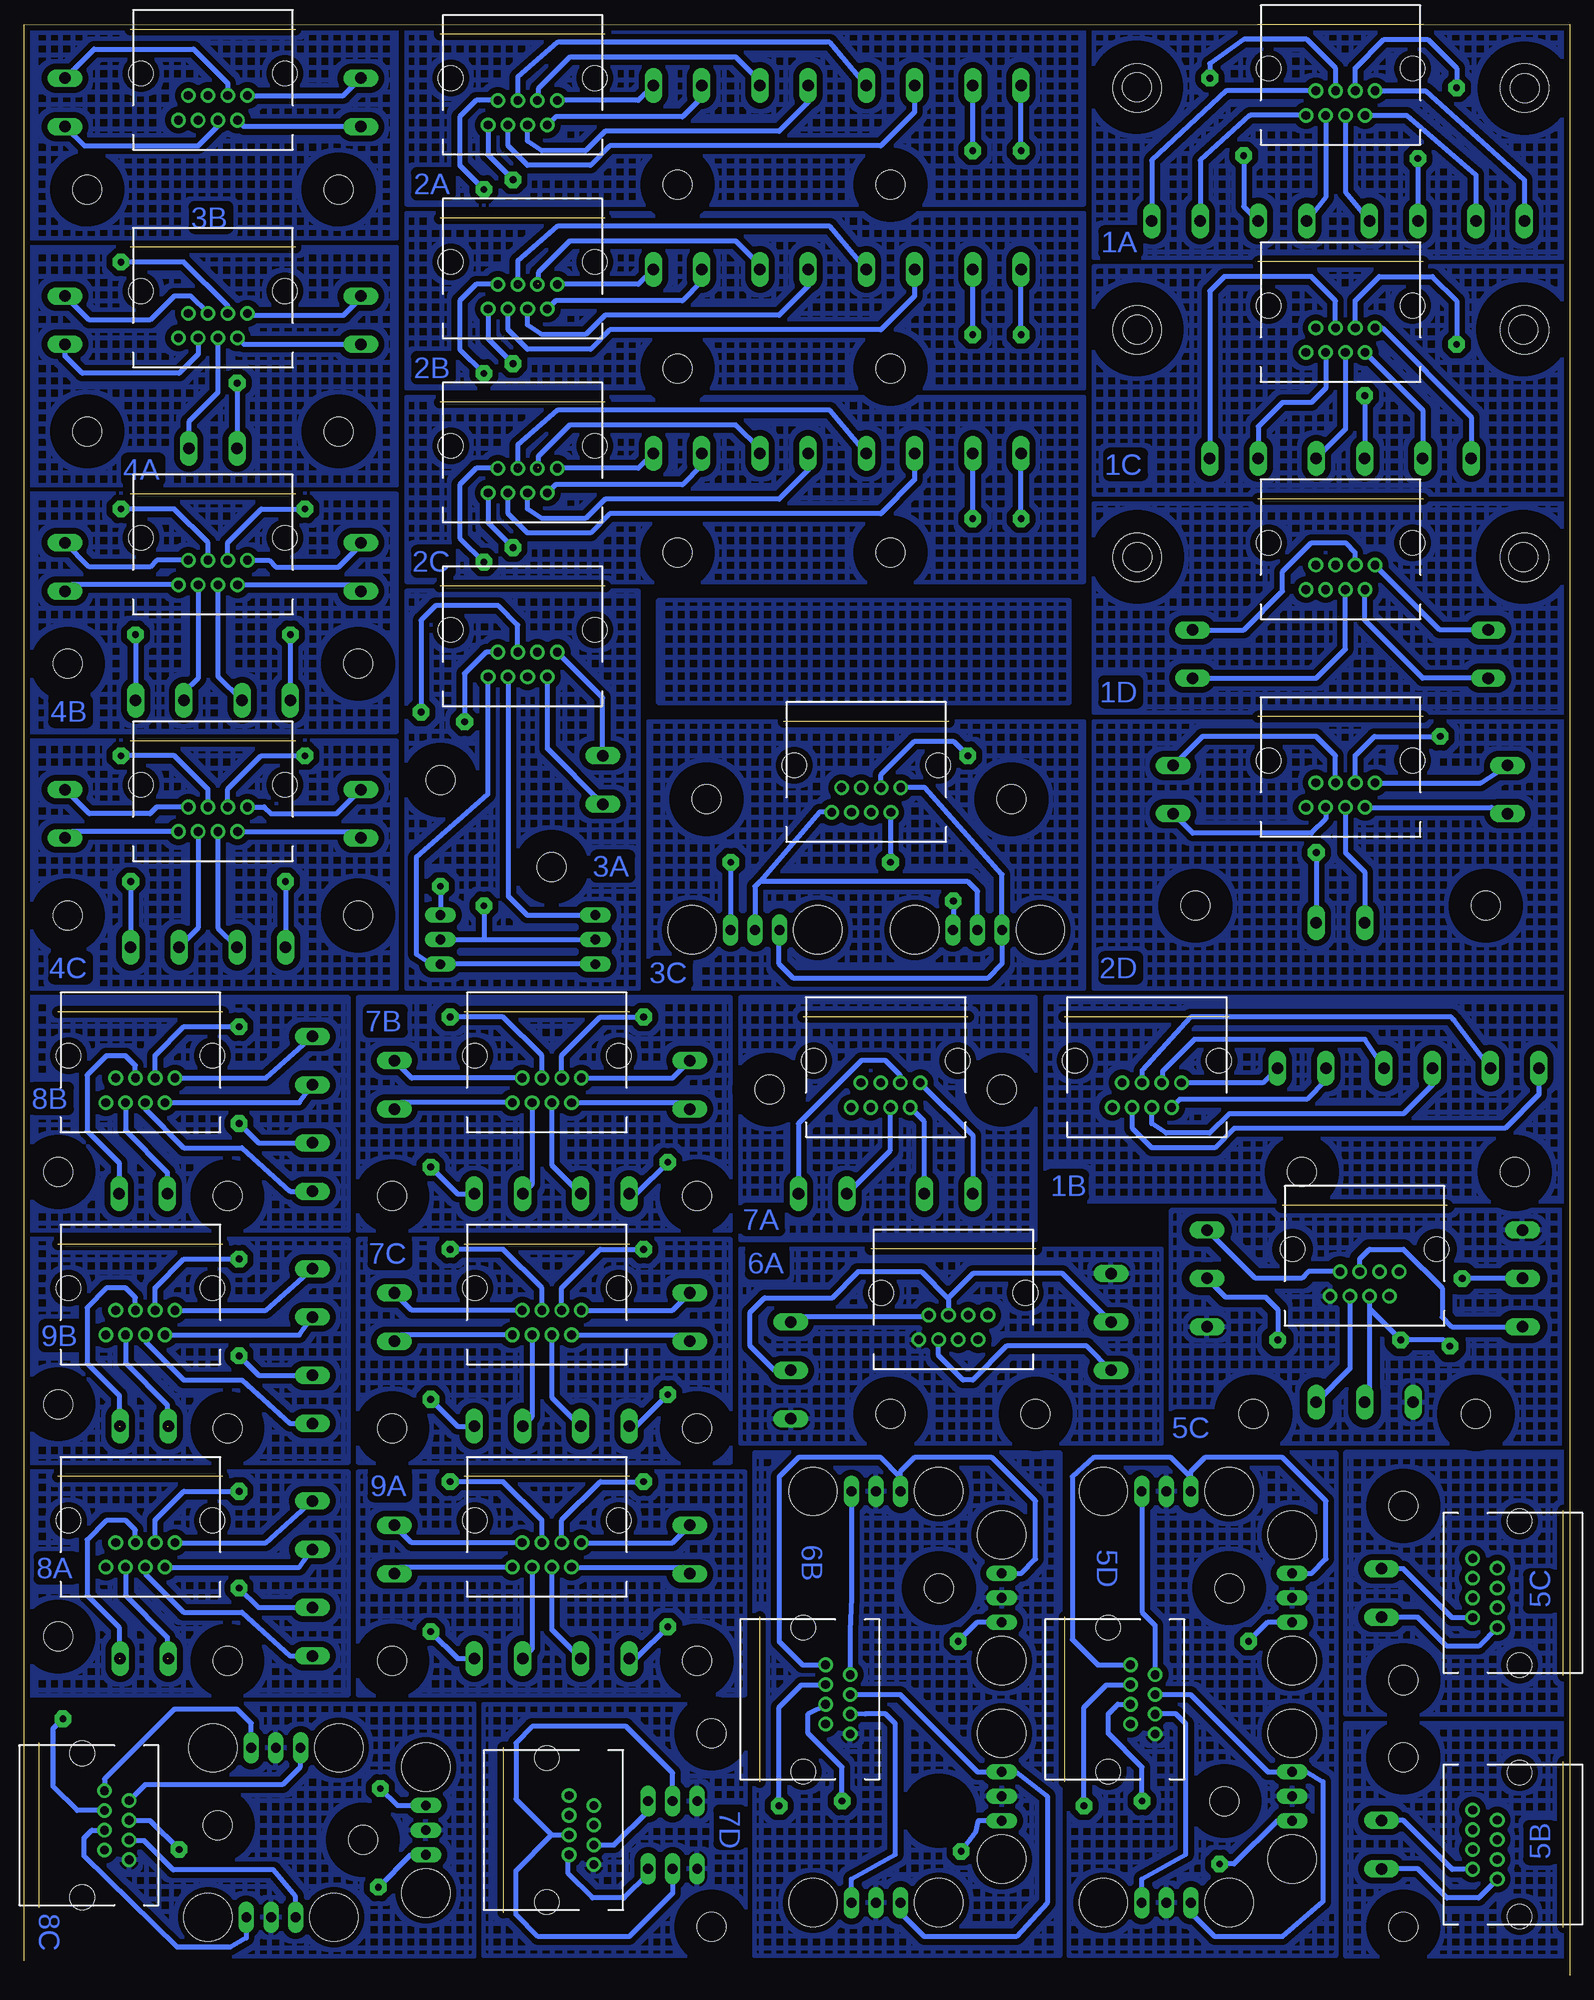
[diagram p10: board, bottom side, seen from below]

Size 159.68 x 201.57 mm. Coordinates in mm from the lower left corner, seen from the top.
Outline: 159.68,1.5 159.68,201.5 0,201.57 0,0
Copper layers (1*16): Top 0.035mm / dielectric 1.5mm / Bottom 0.035mm
Design rules "Dek": minimum track width 12mil, minimum drill 36mil, track to track 12mil, track to pad 12mil, pad to pad 12mil, via to via 12mil, smd to smd 0mil, copper to edge 10mil, drill to drill 12mil, minimum pad ring 12mil, minimum via ring 20mil, stop-mask expansion 4mil, vias tented up to drill 25mil, thermal gap 10mil
Holes 3 mm at 44.68,170.04 4.78,170.04 4.78,146.54 44.68,146.54 242.93,118.75 244.18,103.5 4.63,194.95 44.73,195.05 8.68,110.5 38.68,110.5 70.18,185 92.18,185 70.18,166 92.18,166 70.18,147 92.18,147 57.68,121.5 89.18,121.5 116.68,123.5 105.18,114.5 127.18,159.5 153.18,159.5 127.18,184.5 153.18,184.5 125.18,135.5 155.18,135.5 125.18,109.5 155.18,109.5 5.68,83 27.68,83 32.68,58 9.68,58 17.18,48.5 17.18,30.5 17.18,22.5 17.18,5 70.18,58 55.18,58 35.18,40 35.68,18 58.68,91.5 82.68,91.5 65.18,40 138.68,80.5 124.68,14 139.68,15.5 88.68,25 88.68,5 156.18,83 138.68,56.5 156.18,59 138.68,32.5 156.18,35 90.18,32.5 121.68,32.5 121.68,56.5 90.18,56.5 90.18,80.5 121.68,80.5
Holes 5 mm at 244.68,88.5 54.68,108 67.68,108 77.68,108 90.68,108 118.18,8.5 118.18,21.5 140.68,6 127.68,6 140.18,23.5 127.18,23.5 48.18,50 35.18,50 48.18,7.5 35.18,7.5 28.68,12 28.68,25 28.68,45.5 28.68,32.5 58.68,12 58.68,12 58.68,12 58.68,12 58.68,45.5 58.68,32.5 58.68,25 65.18,7.5 78.18,7.5 65.18,50 78.18,50 4.68,146.5 44.68,146.5 44.68,170 4.68,170 44.68,195 4.68,195
bRestrict: area 0.8,142.6 to 8.8,150.6; area 40.7,142.6 to 48.7,150.6; area 0.8,166.1 to 8.8,174.1; area 40.7,166.1 to 48.7,174.1; area 0.7,190.9 to 8.7,198.9; area 40.8,191.1 to 48.8,199.1; area 5.7,107.5 to 11.7,113.5; area 35.7,107.5 to 41.7,113.5; area 67.2,182 to 73.2,188; area 89.2,182 to 95.2,188; area 67.2,163 to 73.2,169; area 89.2,163 to 95.2,169; 46 more areas; 115 lines
vRestrict: area 52.2,105.5 to 57.2,110.5; area 65.2,105.5 to 70.2,110.5; area 75.2,105.5 to 80.2,110.5; area 88.2,105.5 to 93.2,110.5; area 115.7,6 to 120.7,11; area 115.7,19 to 120.7,24; area 138.2,3.5 to 143.2,8.5; area 125.2,3.5 to 130.2,8.5; area 137.7,21 to 142.7,26; area 124.7,21 to 129.7,26; area 45.7,47.5 to 50.7,52.5; area 32.7,47.5 to 37.7,52.5; 14 more areas; 52 lines

### Footprints (pad centres in the part's own frame; a part is rotated, then mirrored left to right if it is on the bottom)
GLX-S-88M = drill 0.9 pad 1.422: 1 -3.57,-2.3; 2 -2.55,-4.84; 3 -1.53,-2.3; 4 -0.51,-4.84; 5 0.51,-2.3; 6 1.53,-4.84; 7 2.55,-2.3; 8 3.57,-4.84 | hole 2.55: -7.44,0; 7.44,0
W237-102 = drill 1.194 long: 1 -2.5,-1.27; 2 2.5,-1.27
1X03 = drill 1.016 long: 1 -2.54,0; 2 0,0; 3 2.54,0
W237-103 = drill 1.194 long: 1 -5,-1.29; 2 0,-1.29; 3 5,-1.29

### Placement (x,y rotation side)
1A  23.68,197 0 top
1A-HUB1  7.18,182.5 0 top
1A-HUB2  18.18,182.5 0 top
1A-HUB3  29.68,182.5 0 top
1A-HUB4  40.68,182.5 0 top
1B  43.68,94.5 0 top
1B-HUB1  27.68,95 0 top
1B-HUB2  16.68,95 0 top
1B-HUB3  5.68,95 0 top
1C  23.68,172.5 0 top
1C-HUB1  12.68,158 0 top
1C-HUB2  23.68,158 0 top
1C-HUB3  34.68,158 0 top
1D  23.68,148 0 top
1D-HUB1  9.68,136.5 270 top
1D-HUB2  37.68,136.5 90 top
2A  108.18,196 0 top
2A-HUB1  92.18,196.5 0 top
2A-HUB2  81.18,196.5 0 top
2A-HUB3  70.18,196.5 0 top
2A-HUB4  59.18,196.5 0 top
2B  108.18,177 0 top
2B-HUB1  92.18,177.5 0 top
2B-HUB2  81.18,177.5 0 top
2B-HUB3  70.18,177.5 0 top
2B-HUB4  59.18,177.5 0 top
2C  108.18,158 0 top
2C-HUB1  92.18,158.5 0 top
2C-HUB2  81.18,158.5 0 top
2C-HUB3  70.18,158.5 0 top
2C-HUB4  59.18,158.5 0 top
2D  23.68,125.5 0 top
2D-HUB1  7.68,122.5 270 top
2D-HUB2  23.68,110 0 top
2D-HUB3  39.68,122.5 90 top
3A  108.18,139 0 top
3A-HUB1  101.18,123.5 270 top
3A_HUB2  100.68,107 90 top
3A_HUB3  116.68,107 90 top
3B  140.18,196.5 0 top
3B-HUB1  126.18,193.5 270 top
3B-HUB2  154.18,193.5 90 top
3C  72.68,125 0 top
3C_HUB1  84.18,108 0 top
3C_HUB2  61.18,108 0 top
4A  140.18,174 0 top
4A-HUB1  126.18,171 270 top
4A-HUB2  140.18,159 0 top
4A-HUB3  154.18,171 90 top
4B  140.18,148.5 0 top
4B-HUB1  126.18,145.5 270 top
4B-HUB2  134.68,133 0 top
4B-HUB3  145.68,133 0 top
4B-HUB4  154.18,145.5 90 top
4C  140.18,123 0 top
4C-HUB1  126.18,120 270 top
4C-HUB2  135.18,107.5 0 top
4C-HUB3  146.18,107.5 0 top
4C-HUB4  154.18,120 90 top
5A  5.18,39.5 90 top
5A-HU1  18.18,39.5 90 top
5B  5.18,13.5 90 top
5B-HUB1  18.18,13.5 90 top
5C  21.18,75 0 top
5C-HUB1  6.18,72 270 top
5C-HUB2  21.18,60.5 0 top
5C-HUB3  36.18,72 90 top
5D  47.68,28.5 270 top
5D_HUB1  41.68,50 0 top
5D_HUB2  28.68,39 270 top
5D_HUB3  28.68,18.5 270 top
5D_HUB4  41.68,7.5 0 top
6A  63.68,70.5 0 top
6A-HUB1  48.68,67.5 270 top
6A-HUB2  79.18,62.5 90 top
6B  79.18,28.5 270 top
6B_HUB1  71.68,50 0 top
6B_HUB2  58.68,39 270 top
6B_HUB3  58.68,18.5 270 top
6B_HUB4  71.68,7.5 0 top
7A  70.68,94.5 0 top
7A-HUB1  64.18,82 0 top
7A-HUB2  77.18,82 0 top
7B  105.68,95 0 top
7B-HUB1  92.18,92 270 top
7B-HUB2  99.68,82 0 top
7B-HUB3  110.68,82 0 top
7B-HUB4  120.18,92 90 top
7C  105.68,71 0 top
7C-HUB1  92.18,68 270 top
7C-HUB2  99.68,58 0 top
7C-HUB3  110.68,58 0 top
7C-HUB4  120.18,68 90 top
7D  105.68,15 270 top
7D_HUB1  92.68,18 0 top
7D_HUB2  92.68,11 0 top
8A  147.68,47 0 top
8A-HU1  131.18,46.5 270 top
8A-HU2  131.18,35.5 270 top
8A-HU3  147.28,34 0 top
8B  147.68,95 0 top
8B-HUB1  131.18,94.5 270 top
8B-HUB2  131.18,83.5 270 top
8B-HUB3  147.38,82 0 top
8C  153.68,15.5 270 top
8C_HUB1  133.68,23.5 180 top
8C_HUB2  118.18,15 90 top
8C_HUB3  134.18,6 180 top
9A  105.68,47 0 top
9A-HUB1  92.18,44 270 top
9A-HUB2  99.68,34 0 top
9A-HUB3  110.68,34 0 top
9A-HUB4  120.18,44 90 top
9B  147.68,71 0 top
9B-HUB1  131.18,70.5 270 top
9B-HUB2  131.18,59.5 270 top
9B-HUB3  147.28,58 0 top

### Tracks (layer width: path | path; a pad name or v marks a point on that pad's centre or on a via)
1LB1+
  Bottom 0.508: 1B-HUB1.2 31.71,92.2 1B.1
1LB1-
  Bottom 0.508: 1B-HUB1.1 25.18,92.5 27.18,90.5 40.29,90.5 1B.2
1LB2+
  Bottom 0.508: 1B-HUB2.2 21.15,96.7 38.78,96.7 42.08,93.4 42.08,92.27 1B.3 42.15,92.53
1LB2-
  Bottom 0.508: 43.17,89.49 1B.4 43.18,88 41.68,87 37.18,87 35.18,89 17.18,89 14.18,92 1B-HUB2.1
1LB3+
  Bottom 0.508: 1B-HUB3.2 11.95,98.7 12.25,99 39.18,99 44.18,93.5 1B.5
1LB3-
  Bottom 0.508: 1B-HUB3.1 3.18,91 6.68,87.5 34.68,87.5 36.68,85.5 43.18,85.5 45.18,87.5 45.18,89.63 1B.6
1LC1+
  Bottom 0.508: 1C.1 19.38,170.2 10.18,161 1C-HUB1.1
1LC1-
  Bottom 0.508: 1C.2 15.18,161.71 1C-HUB1.2
1LC2+  (via drill 0.7)
  Top 0.61: v11.68,168.5 11.68,165 13.68,163 v21.18,163.2
  Bottom 0.508: 1C.3 22.15,173.03 19.68,175.5 14.18,175.5 11.68,173 v11.68,168.5 | v21.18,163.2 1C-HUB2.1
1LC2-
  Bottom 0.508: 1C.4 23.17,159.74 1C-HUB2.2
1LC3+
  Bottom 0.508: 1C.5 24.19,173.01 26.68,175.5 35.68,175.5 37.18,174 1C-HUB3.2
1LC3-
  Bottom 0.508: 1C.6 25.21,163.97 26.68,162.5 29.68,162.5 32.18,160 1C-HUB3.1
1LD1+
  Bottom 0.508: 1D-HUB1.1 13.41,139 1D.1
1LD1-
  Bottom 0.508: 1D-HUB1.2 15.18,134 21.18,140 21.18,143.11 1D.2
1LD2+
  Bottom 0.508: 1D-HUB2.2 33.68,139 29.68,143 29.68,145 26.68,148 23.18,148 22.18,147 22.18,145.73 1D.3
1LD2-
  Bottom 0.508: 1D-HUB2.1 26.18,134 23.18,137 1D.4
1MA1+
  Bottom 0.508: 1A.1 14.88,194.7 4.68,185.5 1A-HUB1.1
1MA1-
  Bottom 0.508: 1A.2 16.84,192.16 9.68,186 1A-HUB1.2
1MA2+  (via drill 0.7)
  Top 0.61: v11.68,195 11.68,192.5 v15.68,187.7
  Bottom 0.508: 1A.3 22.15,197.03 19.18,200 14.68,200 11.68,197 v11.68,195 | v15.68,187.7 1A-HUB2.1
1MA2-
  Bottom 0.508: 1A.4 23.17,184.22 1A-HUB2.2
1MA3+  (via drill 0.7)
  Top 0.508: 33.68,190.5 v33.68,188
  Top 0.61: v37.18,196 33.68,190.5
  Bottom 0.508: 1A.5 24.18,197 27.18,200 33.68,200 37.18,197.5 v37.18,196 | v33.68,188 33.68,182.73 1A-HUB3.2
1MA3-
  Bottom 0.508: 1A.6 25.21,183.7 1A-HUB3.1
1MA4+
  Bottom 0.508: 1A.7 35.48,194.7 43.18,187.5 1A-HUB4.2
1MA4-
  Bottom 0.508: 1A.8 33.02,192.16 38.18,187.5 1A-HUB4.1
2LC1+
  Bottom 0.508: 2C-HUB1.2 96.21,155.7 2C.1
2LC1-
  Bottom 0.508: 2C-HUB1.1 89.68,156 91.68,154 104.79,154 2C.2
2LC2+  (1 unrouted)
  Bottom 0.508: 106.58,155.77 106.58,156.9 103.28,160.2 86.18,160.2 83.68,157.7 2C-HUB2.2
2LC2-
  Bottom 0.508: 107.67,152.99 2C.4 107.68,151.5 106.18,150.5 101.68,150.5 99.68,152.5 81.68,152.5 78.68,155.5 2C-HUB2.1
2LC3+  (1 unrouted)
  Bottom 0.508: 2C-HUB3.2 76.45,161.7 104.58,161.7 108.68,158.1 2C.5
2LC3-
  Bottom 0.508: 2C-HUB3.1 67.68,154.5 71.18,151 99.18,151 101.18,149 107.68,149 109.68,151 109.68,153.13 2C.6
2LC4+  (via drill 0.7)
  Top 0.61: v112.18,146 67.18,145 v61.68,150.5
  Bottom 0.508: 2C.7 112.98,155.7 114.68,154 114.68,148.5 v112.18,146 | v61.68,150.5 2C-HUB4.2
2LC4-  (via drill 0.7)
  Top 0.61: v109.18,147.5 59.68,147.5 v56.68,150.5
  Bottom 0.508: 2C.8 111.75,150.07 v109.18,147.5 | v56.68,150.5 2C-HUB4.1
2LD1+
  Bottom 0.508: 2D.1 9.21,123.2 2D-HUB1.1
2LD1-
  Bottom 0.508: 2D.2 8.07,120.66 2D-HUB1.2
2LD2+  (via drill 0.7)
  Top 0.61: v13.38,128 13.48,118.3 15.68,116 v26.18,116
  Bottom 0.508: 2D.3 22.15,126.03 20.18,128 v13.38,128 | v26.18,116 2D-HUB2.2
2LD2-
  Bottom 0.508: 2D.4 23.17,115.99 21.18,114 2D-HUB2.1
2LD3+
  Bottom 0.508: 2D.5 24.19,126.01 26.18,128 37.95,128 2D-HUB3.2
2LD3-
  Bottom 0.508: 2D.6 25.21,119.47 26.68,118 38.95,118 2D-HUB3.1
2MA1+
  Bottom 0.508: 2A-HUB1.2 96.21,193.7 2A.1
2MA1-
  Bottom 0.508: 2A-HUB1.1 89.68,194 91.68,192 104.79,192 2A.2
2MA2+
  Bottom 0.508: 106.65,194.03 2A.3 106.58,193.77 106.58,194.9 103.28,198.2 86.18,198.2 83.68,195.7 2A-HUB2.2
2MA2-
  Bottom 0.508: 107.67,190.99 2A.4 107.68,189.5 106.18,188.5 101.68,188.5 99.68,190.5 81.68,190.5 78.68,193.5 2A-HUB2.1
2MA3+
  Bottom 0.508: 2A-HUB3.2 76.45,199.7 104.58,199.7 108.68,196.1 2A.5
2MA3-
  Bottom 0.508: 2A-HUB3.1 67.68,192.5 71.18,189 99.18,189 101.18,187 107.68,187 109.68,189 109.68,191.13 2A.6
2MA4+  (via drill 0.7)
  Top 0.61: v112.18,184.5 67.18,184 v61.68,188.5
  Bottom 0.508: 2A.7 112.98,193.7 114.68,192 114.68,187 v112.18,184.5 | v61.68,188.5 2A-HUB4.2
2MA4-  (via drill 0.7)
  Top 0.61: v109.18,185.5 59.68,185.5 v56.68,188.5
  Bottom 0.508: 2A.8 111.75,188.07 v109.18,185.5 | v56.68,188.5 2A-HUB4.1
2MB1+
  Bottom 0.508: 2B-HUB1.2 96.21,174.7 2B.1
2MB1-
  Bottom 0.508: 2B-HUB1.1 89.68,175 91.68,173 104.79,173 2B.2
2MB2+  (1 unrouted)
  Bottom 0.508: 106.65,175.03 2B.3 | 106.58,174.77 106.58,175.9 103.28,179.2 86.18,179.2 83.68,176.7 2B-HUB2.2
2MB2-
  Bottom 0.508: 107.67,171.99 2B.4 107.68,170.5 106.18,169.5 101.68,169.5 99.68,171.5 81.68,171.5 78.68,174.5 2B-HUB2.1
2MB3+  (1 unrouted)
  Bottom 0.508: 2B-HUB3.2 76.45,180.7 104.58,180.7 108.68,177.1 2B.5
2MB3-
  Bottom 0.508: 2B-HUB3.1 67.68,173.5 71.18,170 99.18,170 101.18,168 107.68,168 109.68,170 109.68,172.13 2B.6
2MB4+  (via drill 0.7)
  Top 0.61: v112.18,165.5 66.18,165.5 v61.68,169.5
  Bottom 0.508: 2B.7 112.98,174.7 114.68,173 114.68,168 v112.18,165.5 | v61.68,169.5 2B-HUB4.2
2MB4-  (via drill 0.7)
  Top 0.61: v109.18,166.5 59.68,166.5 v56.68,169.5
  Bottom 0.508: 2B.8 111.75,169.07 v109.18,166.5 | v56.68,169.5 2B-HUB4.1
3A_5VM  (via drill 0.7)
  Top 0.61: v118.68,130.5 118.68,118 v112.18,110.5
  Bottom 0.508: 3A_HUB3.2 112.18,107 | 112.18,107 3A_HUB2.2 | 3A.5 108.69,139.51 110.68,141.5 117.18,141.5 118.68,140 v118.68,130.5 | v112.18,110.5 112.18,107
3A_GND
  Bottom 0.508: 3A_HUB2.1 3A_HUB3.1 117.64,104.46 119.18,105.5 119.18,115.5 111.78,122 111.78,134.09 3A.8
3C_5V
  Bottom 0.508: 3C_HUB1.1 81.68,108.46 81.68,104.5 80.18,103 60.18,103 58.64,104.54 3C_HUB2.1 58.64,113.73 66.61,122.7 3C.1
3C_GND
  Bottom 0.508: 3C_HUB2.2 61.18,112 62.18,113 83.68,113 | 83.68,113 84.18,112.5 3C_HUB1.2 | 3C.8 77.52,120.16 83.68,113
3MA1+
  Bottom 0.508: 3A-HUB1.1 99.91,132 3A.1
3MA1-
  Bottom 0.508: 3A-HUB1.2 105.63,126.72 3A.2
3MB1+
  Bottom 0.508: 3B.1 126.71,194.2 3B-HUB1.1
3MB1-
  Bottom 0.508: 3B-HUB1.2 136.97,191 3B.2
3MB2+
  Bottom 0.508: 3B-HUB2.2 152.45,199 142.18,199 138.65,195.47 3B.3
3MB2-
  Bottom 0.508: 3B-HUB2.1 153.45,189 141.68,189 139.67,191.01 3B.4
3P2  (via drill 0.7)
  Top 0.61: v70.18,115 70.68,115.5 v86.68,115
  Bottom 0.508: 3C.2 70.18,120.11 v70.18,115 | v86.68,115 86.72,115.46 3C_HUB1.3
3P3  (via drill 0.7)
  Top 0.61: v62.18,126 62.18,113.5 v63.68,111
  Bottom 0.508: 3C.3 71.15,124.03 67.68,127.5 63.68,127.5 v62.18,126 | v63.68,111 63.68,108.54 3C_HUB2.3
3P7
  Bottom 0.508: 3A.6 109.68,133.69 109.68,111.5 107.72,109.54 3A_HUB2.3
3P8  (via drill 0.7)
  Top 0.61: v114.18,129.5 114.18,115 v116.68,112.5
  Bottom 0.508: 3A.7 111.98,136.7 114.18,134.5 v114.18,129.5 | v116.68,112.5 3A_HUB3.3
4LC1+
  Bottom 0.508: 4C.1 134.88,120.7 134.18,120 127.41,120 4C-HUB1.1
4LC1-
  Bottom 0.508: 4C.2 125.57,118.16 4C-HUB1.2
4LC2+  (via drill 0.7)
  Top 0.61: v130.68,126 130.68,115 v132.68,113
  Bottom 0.508: 4C.3 138.65,122.53 135.18,126 v130.68,126 | v132.68,113 4C-HUB2.1
4LC2-
  Bottom 0.508: 4C.4 139.67,108.22 4C-HUB2.2
4LC3+  (via drill 0.7)
  Top 0.61: v149.68,126 149.18,113.5 v148.68,113
  Bottom 0.508: 4C.5 140.69,122.51 144.18,126 v149.68,126 | v148.68,113 4C-HUB3.2
4LC3-
  Bottom 0.508: 4C.6 141.71,108.2 4C-HUB3.1
4LC4+
  Bottom 0.508: 4C.7 145.98,120.7 146.68,120 152.95,120 4C-HUB4.2
4LC4-
  Bottom 0.508: 4C.8 154.79,118.16 4C-HUB4.1
4MA1+
  Bottom 0.508: 4A.1 136.41,171.5 126.68,171.5 124.91,173.27 4A-HUB1.1
4MA1-
  Bottom 0.508: 4A.2 136.97,168.5 4A-HUB1.2
4MA2+  (via drill 0.7)
  Top 0.61: v149.68,177 149.68,167 147.18,164.5 v137.68,164.5
  Bottom 0.508: 4A.3 138.65,172.47 143.18,177 v149.68,177 | v137.68,164.5 4A-HUB2.1
4MA2-
  Bottom 0.508: 4A.4 139.67,163.51 142.68,160.5 4A-HUB2.2
4MA3+
  Bottom 0.508: 4A.5 142.49,173.5 144.18,173.5 146.68,171 152.95,171 4A-HUB3.2
4MA3-
  Bottom 0.508: 4A.6 141.68,169.13 141.68,167.5 143.68,165.5 153.68,165.5 155.45,167.27 4A-HUB3.1
4MB1+
  Bottom 0.508: 4B.1 134.38,146.2 133.68,145.5 127.18,145.5 124.91,147.77 4B-HUB1.1
4MB1-
  Bottom 0.508: 4B.2 125.57,143.66 4B-HUB1.2
4MB2+  (via drill 0.7)
  Top 0.61: v130.68,151.5 130.68,139 131.18,139 v132.18,138.5
  Bottom 0.508: 4B.3 138.65,148.03 135.18,151.5 v130.68,151.5 | v132.18,138.5 4B-HUB2.1
4MB2-
  Bottom 0.508: 4B.4 139.67,134.22 4B-HUB2.2
4MB3+  (via drill 0.7)
  Top 0.61: v149.68,151.5 149.68,140 v148.18,138.5
  Bottom 0.508: 4B.5 140.69,148.01 144.18,151.5 v149.68,151.5 | v148.18,138.5 4B-HUB3.2
4MB3-
  Bottom 0.508: 4B.6 141.71,133.97 143.18,132.5 4B-HUB3.1
4MB4+
  Bottom 0.508: 4B.7 145.98,146.2 146.68,145.5 152.95,145.5 4B-HUB4.2
4MB4-
  Bottom 0.508: 4B.8 154.79,143.66 4B-HUB4.1
5C_5VM  (via drill 0.7)
  Top 0.61: v30.16,65.64 v17.46,65.64 | v11.11,71.98 11.11,65.64 11.74,65 v12.38,65
  Bottom 0.508: 5C-HUB2.2 20.67,59.72 5C.4 20.67,68.84 v17.46,65.64 13.02,65.64 v12.38,65 | 5C-HUB3.2 35.55,70.08 31.43,70.08 30.16,68.81 v30.16,65.64 | 5C-HUB1.2 4.9,71.98 v11.11,71.98
5C_GND
  pour Bottom (isolate 0.813, hatched): 0.18,79 41.18,79 41.18,55 0.18,55
5D_5V1
  Bottom 0.508: 5D_HUB2.1 26.64,41.54 25.18,43 25.18,49 29.68,53.5 37.68,53.5 39.18,52 39.18,51.5 | 5D_HUB1.1 39.18,50.04 39.18,51.5 | 39.18,51.5 41.18,53.5 49.18,53.5 51.38,51.5 51.38,34.7 48.75,32.07 5D.1
5D_5V2
  Bottom 0.508: 5D_HUB4.1 39.18,7.46 39.18,6.5 36.68,4 29.68,4 25.48,7.6 25.48,20 27.22,21.04 5D_HUB3.1 28.72,21 31.18,21 39.19,29.01 5D.4
5D_GND
  pour Bottom (isolate 0.61, hatched): 24.18,54 24.18,2 51.71,2 51.68,54
5MA1+
  Bottom 0.508: 5A.1 9.41,34 12.68,34 15.68,37 5A-HU1.1
5MA1-
  Bottom 0.508: 5A.2 12.13,36.95 17.18,42 5A-HU1.2
5MB1+
  Bottom 0.508: 5B.1 9.41,8 12.68,8 15.68,11 5B-HUB1.1
5MB1-
  Bottom 0.508: 5B.2 12.13,10.95 17.18,16 5B-HUB1.2
5P2
  Bottom 0.508: 5D_HUB1.3 44.18,49.96 44.18,37.5 42.84,36.16 5D.2
5P3  (via drill 0.7)
  Top 0.61: v33.18,34.5 33.18,24.5 41.68,16 48.68,16 v50.18,17.5
  Bottom 0.508: 5D_HUB2.3 31.22,36.46 v33.18,34.5 | v50.18,17.5 50.18,27.7 47.88,30 45.41,30 5D.3
5P4  (via drill 0.7)
  Top 0.61: v36.18,11.5 37.68,11.5 v44.18,18
  Bottom 0.508: 5D_HUB3.3 30.22,15.96 34.68,11.5 v36.18,11.5 | v44.18,18 44.18,21.5 47.68,25 47.68,27 46.68,28 5D.5
5P5
  Bottom 0.508: 5D_HUB4.3 44.22,9.96 39.68,12.5 39.68,26 40.68,27 42.81,27 5D.6
5P6
  Bottom 0.508: 5C.5 21.69,73.99 20.68,75 17.18,75 13.18,71 13.18,68 12.18,67 5C-HUB1.3
5P7
  Bottom 0.508: 5C.6 22.71,62.68 5C-HUB2.3
5P8
  Bottom 0.508: 5C.7 26.98,72.7 27.68,72 32.47,72 5C-HUB3.3
6A_5VM
  Bottom 0.508: 6A-HUB1.2 52.39,72.5 61.68,72.5 64.19,69.99 | 64.19,69.99 6A.5 | 6A-HUB2.2 82.18,62.5 84.68,65 84.68,68.5 83.18,70 76.18,70 73.58,72.6 73.58,72.7 66.98,72.7 64.27,69.99 64.19,69.99
6A_GND
  pour Bottom (isolate 0.61, hatched): 42.18,75 85.68,75 85.68,55 42.18,55
6B_5V1
  Bottom 0.508: 6B_HUB2.1 56.64,41.54 55.18,43 55.18,49 59.68,53.5 67.68,53.5 69.18,52 69.18,51.5 | 6B_HUB1.1 69.18,50.04 69.18,51.5 | 69.18,51.5 71.18,53.5 79.68,53.5 81.68,51.5 81.68,34.5 79.25,32.07 6B.1 76.61,32.07 76.68,32
6B_5V2
  Bottom 0.508: 6B_HUB4.1 69.18,7.46 69.18,6.5 66.68,4 57.18,4 53.98,7.5 53.98,18.5 57.22,21.04 6B_HUB3.1 58.72,21 61.18,21 69.19,29.01 6B.4
6B_GND
  pour Bottom (isolate 0.61, hatched): 52.68,54 52.68,2 84.18,2 84.18,54
6P2
  Bottom 0.508: 6B_HUB1.3 74.18,49.96 74.18,39 74.34,35.66 6B.2
6P3  (via drill 0.7)
  Top 0.61: v63.18,34.5 63.18,24.5 71.68,16 78.68,16 v81.68,17.5
  Bottom 0.508: 6B_HUB2.3 61.22,36.46 v63.18,34.5 | v81.68,17.5 81.68,27.7 79.38,30 76.91,30 6B.3
6P4  (via drill 0.7)
  Top 0.61: v62.88,12.8 67.68,11.5 v75.18,18
  Bottom 0.508: 6B_HUB3.3 61.12,15.96 61.38,14.8 v62.88,12.8 | v75.18,18 75.18,21.5 78.68,25 78.68,27 76.68,28 6B.5
6P5
  Bottom 0.508: 6B_HUB4.3 74.22,9.96 69.68,12.5 69.68,26 70.68,27 72.81,27 6B.6
6P6
  Bottom 0.508: 6A-HUB1.3 49.89,65 58.18,65 61.68,61.5 62.68,61.5 65.21,64.03 6A.6
6P7
  Bottom 0.508: 6A.7 66.43,68 79.18,68 6A-HUB2.3
7D_5VM
  Bottom 0.508: 7D_HUB1.2 92.68,20.9 97.48,25.7 107.18,25.7 108.88,24 108.88,18.2 105.18,14.5 | 105.18,14.5 7D.5 | 7D_HUB2.2 92.68,8.5 97.18,4 106.58,4 108.88,6.3 108.88,10.8 105.18,14.5
7D_GND
  pour Bottom (isolate 0.61, hatched): 85.18,2 112.18,2 112.18,28 85.18,28
7LB1+
  Bottom 0.508: 7B.1 92.71,92.7 7B-HUB1.1
7LB1-
  Bottom 0.508: 7B.2 91.57,90.16 7B-HUB1.2
7LB2+  (via drill 0.7)
  Top 0.406: v95.68,99 93.18,96.5 v93.18,84
  Bottom 0.508: 7B.3 104.15,95.03 100.18,99 v95.68,99 | v93.18,84 96.45,80.73 7B-HUB2.1
7LB2-
  Bottom 0.508: 7B.4 105.17,83.72 7B-HUB2.2
7LB3+  (via drill 0.7)
  Top 0.406: v115.68,99 115.68,86 v117.68,83.5
  Bottom 0.508: 7B.5 106.19,95.01 110.18,99 v115.68,99 | v117.68,83.5 114.91,80.73 7B-HUB3.2
7LB3-
  Bottom 0.508: 7B.6 107.21,81.7 7B-HUB3.1
7LB4+
  Bottom 0.508: 7B.7 119.65,92.7 7B-HUB4.2
7LB4-
  Bottom 0.508: 7B.8 120.79,90.16 7B-HUB4.1
7LC1+
  Bottom 0.508: 7C.1 92.71,68.7 7C-HUB1.1
7LC1-
  Bottom 0.508: 7C.2 91.57,66.16 7C-HUB1.2
7LC2+  (via drill 0.7)
  Top 0.406: v95.68,75 93.18,72.5 v93.18,60
  Bottom 0.508: 7C.3 104.15,71.03 100.18,75 v95.68,75 | v93.18,60 96.45,56.73 7C-HUB2.1
7LC2-
  Bottom 0.508: 7C.4 105.17,59.72 7C-HUB2.2
7LC3+  (via drill 0.7)
  Top 0.406: v115.68,75 115.68,62 v117.68,59.5
  Bottom 0.508: 7C.5 106.19,71.01 110.18,75 v115.68,75 | v117.68,59.5 114.91,56.73 7C-HUB3.2
7LC3-
  Bottom 0.508: 7C.6 107.21,57.7 7C-HUB3.1
7LC4+
  Bottom 0.508: 7C.7 119.65,68.7 7C-HUB4.2
7LC4-
  Bottom 0.508: 7C.8 120.79,66.16 7C-HUB4.1
7MA1+
  Bottom 0.508: 7A.1 61.68,86.77 7A-HUB1.1
7MA1-
  Bottom 0.508: 7A-HUB1.2 66.68,88.21 7A.2
7MA2+
  Bottom 0.508: 7A.3 69.18,92.23 69.18,93 70.68,94.5 73.18,94.5 79.68,88 7A-HUB2.2
7MA2-
  Bottom 0.508: 7A-HUB2.1 70.18,85.23 70.18,89 70.17,89.01 7A.4
7P45
  Bottom 0.508: 7D_HUB2.3 95.22,10.46 97.68,8 100.98,8 103.48,10.5 103.48,12.35 7D.7
7P46
  Bottom 0.508: 7D.6 98.71,13.47 95.18,17 95.18,17.96 7D_HUB1.3
8C_5V1
  Bottom 0.508: 8C_HUB1.1 136.22,26.04 137.68,27.5 144.18,27.5 151.38,20.3 8C.1
8C_5V2  (via drill 0.7)
  Top 0.406: v155.68,26.5 126.18,26.5 121.68,22 121.68,10.5 v123.08,9.1
  Bottom 0.508: 8C.3 154.21,17.03 156.68,19.5 156.68,25.5 v155.68,26.5 | v123.08,9.1 119.68,12.5 118.22,12.5 8C_HUB2.1
8C_5V3
  Bottom 0.508: 8C_HUB3.1 136.72,3.86 138.38,2.9 143.88,2.9 153.48,12.3 153.48,14.2 152.68,15 8C.5
8C_GND
  pour Bottom (isolate 0.61, hatched): 113.18,28 159.18,28 159.18,2 113.18,2
8FB1+
  Bottom 0.508: 8B.1 134.71,92.7 8B-HUB1.1
8FB1-
  Bottom 0.508: 8B.2 131.25,90.16 8B-HUB1.2
8FB2+  (via drill 0.7)
  Top 0.406: v137.48,98 v137.48,88
  Bottom 0.508: 8B.3 146.15,95.03 143.18,98 v137.48,98 | v137.48,88 135.48,86 8B-HUB2.1
8FB2-
  Bottom 0.508: 8B.4 147.17,89.49 143.18,85.5 137.18,85.5 132.18,81 8B-HUB2.2
8FB3+
  Bottom 0.508: 8B.5 148.19,94.01 149.18,95 151.18,95 153.18,93 153.18,87.23 149.88,83.93 8B-HUB3.2
8FB3-
  Bottom 0.508: 8B.6 149.21,87.26 144.88,82.93 8B-HUB3.1
8MA1+
  Bottom 0.508: 8A.1 134.71,44.7 8A-HU1.1
8MA1-
  Bottom 0.508: 8A.2 131.25,42.16 8A-HU1.2
8MA2+  (via drill 0.7)
  Top 0.406: v137.48,50 v137.48,40
  Bottom 0.508: 8A.3 146.15,47.03 143.18,50 v137.48,50 | v137.48,40 135.48,38 8A-HU2.1
8MA2-
  Bottom 0.508: 8A.4 147.17,41.49 143.18,37.5 137.18,37.5 132.18,33 8A-HU2.2
8MA3+  (1 unrouted)
  Bottom 0.508: 8A.5 148.19,46.01 149.18,47 151.18,47 153.18,45 153.18,39.23 149.88,35.93 149.88,32.73
8MA3-  (1 unrouted)
  Bottom 0.508: 8A.6 149.21,39.26 144.88,34.93 144.88,32.73
8P44
  Bottom 0.508: 8C_HUB3.3 131.64,8.16 133.88,10.9 144.28,10.9 147.28,13.9 148.77,13.9 8C.6
8P45  (via drill 0.7)
  Top 0.406: v143.68,13 129.18,13 v122.88,19.3
  Bottom 0.508: 8C.4 146.69,16.01 v143.68,13 | v122.88,19.3 121.12,17.54 8C_HUB2.3
8P46
  Bottom 0.508: 8C_HUB1.3 131.18,23.46 131.18,21.5 132.98,19.7 147.19,19.7 8C.2
9LA1+
  Bottom 0.508: 9A.1 92.71,44.7 9A-HUB1.1
9LA1-
  Bottom 0.508: 9A.2 91.57,42.16 9A-HUB1.2
9LA2+  (via drill 0.7)
  Top 0.406: v95.68,51 93.18,48.5 v93.18,36
  Bottom 0.508: 9A.3 104.15,47.03 100.18,51 v95.68,51 | v93.18,36 96.45,32.73 9A-HUB2.1
9LA2-
  Bottom 0.508: 9A.4 105.17,35.72 9A-HUB2.2
9LA3+  (via drill 0.7)
  Top 0.406: v115.68,51 115.68,38 v117.68,35.5
  Bottom 0.508: 9A.5 106.19,47.01 110.18,51 v115.68,51 | v117.68,35.5 114.91,32.73 9A-HUB3.2
9LA3-
  Bottom 0.508: 9A.6 107.21,33.7 9A-HUB3.1
9LA4+
  Bottom 0.508: 9A.7 119.65,44.7 9A-HUB4.2
9LA4-
  Bottom 0.508: 9A.8 120.79,42.16 9A-HUB4.1
9LB1+
  Bottom 0.508: 9B.1 134.71,68.7 9B-HUB1.1
9LB1-
  Bottom 0.508: 9B.2 131.25,66.16 9B-HUB1.2
9LB2+  (via drill 0.7)
  Top 0.406: v137.48,74 v137.48,64
  Bottom 0.508: 9B.3 146.15,71.03 143.18,74 v137.48,74 | v137.48,64 135.48,62 9B-HUB2.1
9LB2-
  Bottom 0.508: 9B.4 147.17,65.49 143.18,61.5 137.18,61.5 132.18,57 9B-HUB2.2
9LB3+  (1 unrouted)
  Bottom 0.508: 9B.5 148.19,70.01 149.18,71 151.18,71 153.18,69 153.18,63.23 149.88,59.93 149.88,56.73
9LB3-  (1 unrouted)
  Bottom 0.508: 9B.6 149.21,63.26 144.88,58.93 144.88,56.73
N$1
  pour Bottom (isolate 0.61, hatched): 126.18,101 159.18,101 159.18,77 126.18,77
N$2
  pour Bottom (isolate 0.61, hatched): 126.18,76 159.18,76 159.18,53 126.18,53
N$3
  pour Bottom (isolate 0.61, hatched): 126.18,52 159.18,52 159.18,29 126.18,29
N$4
  pour Bottom (isolate 0.61, hatched): 86.68,101 125.18,101 125.18,77 86.68,77
N$5
  pour Bottom (isolate 0.61, hatched): 86.68,76 125.18,76 125.18,53 86.68,53
N$6
  pour Bottom (isolate 0.61, hatched): 85.18,52 125.18,52 125.18,29 85.18,29
N$7
  pour Bottom (isolate 0.61, hatched): 55.18,101 85.68,101 85.68,76 55.18,76
N$8
  pour Bottom (isolate 0.61, hatched): 0.18,101 54.18,101 54.18,80 0.18,80
N$9
  pour Bottom (isolate 0.61, hatched): 0.18,54 23.18,54 23.18,27 0.18,27
N$10
  pour Bottom (isolate 0.61, hatched): 0.18,26 23.18,26 23.18,2 0.18,2
N$11
  pour Bottom (isolate 0.61, hatched): 0.18,201 49.18,201 49.18,177.5 0.18,177.5
N$12
  pour Bottom (isolate 0.61, hatched): 0.18,176.5 49.18,176.5 49.18,153 0.18,153
N$13
  pour Bottom (isolate 0.61, hatched): 0.18,152 49.18,152 49.18,131 49.18,130.5 0.18,130.5
N$14
  pour Bottom (isolate 0.61, hatched): 0.18,129.5 49.18,129.5 49.18,102 0.18,102
N$15
  pour Bottom (isolate 0.61, hatched): 50.18,129.5 95.18,129.5 95.18,102 50.18,102
N$16
  pour Bottom (isolate 0.61, hatched): 50.18,163 120.18,163 120.18,144 50.18,144
N$17
  pour Bottom (isolate 0.61, hatched): 50.18,201 120.18,201 120.18,183 50.18,183
N$18
  pour Bottom (isolate 0.61, hatched): 50.18,182 120.18,182 120.18,164 50.18,164
N$19
  pour Bottom (isolate 0.61, hatched): 96.18,143 120.18,143 120.18,102 96.18,102
N$20
  pour Bottom (isolate 0.61, hatched): 121.18,178.5 159.18,178.5 159.18,154 121.18,154
N$21
  pour Bottom (isolate 0.61, hatched): 121.18,201 159.18,201 159.18,179.5 121.18,179.5
N$22
  pour Bottom (isolate 0.61, hatched): 51.68,142 94.18,142 94.18,131.5 51.68,131.5
N$23
  pour Bottom (isolate 0.61, hatched): 121.18,153 159.18,153 159.18,128.5 121.18,128.5
N$24
  pour Bottom (isolate 0.61, hatched): 121.18,127.5 159.18,127.5 159.18,102 121.18,102

### Text on the board
Bottom: 2A | 3B | 1A | 2B | 1C | 4A | 2C | 1D | 4B | 3A | 2D | 4C | 3C | 7B | 8B | 1B | 7A | 7C | 6A | 9B | 5C | 9A | 6B | 5D | 8A | 5C | 7D | 5B | 8C
Document: parafusos de madeira (cabeça=8mm, furo=3mm) | parafusos normal (cabeça/porca=6mm, furo=3mm) | Buraco p/ LED dos relés (=5mm) | Buraco p/ RJ45 (=2mm)